# EAGLE schematic ESC (EAGLE 9.5.1)

## Sheet 1 of 8: Connectors
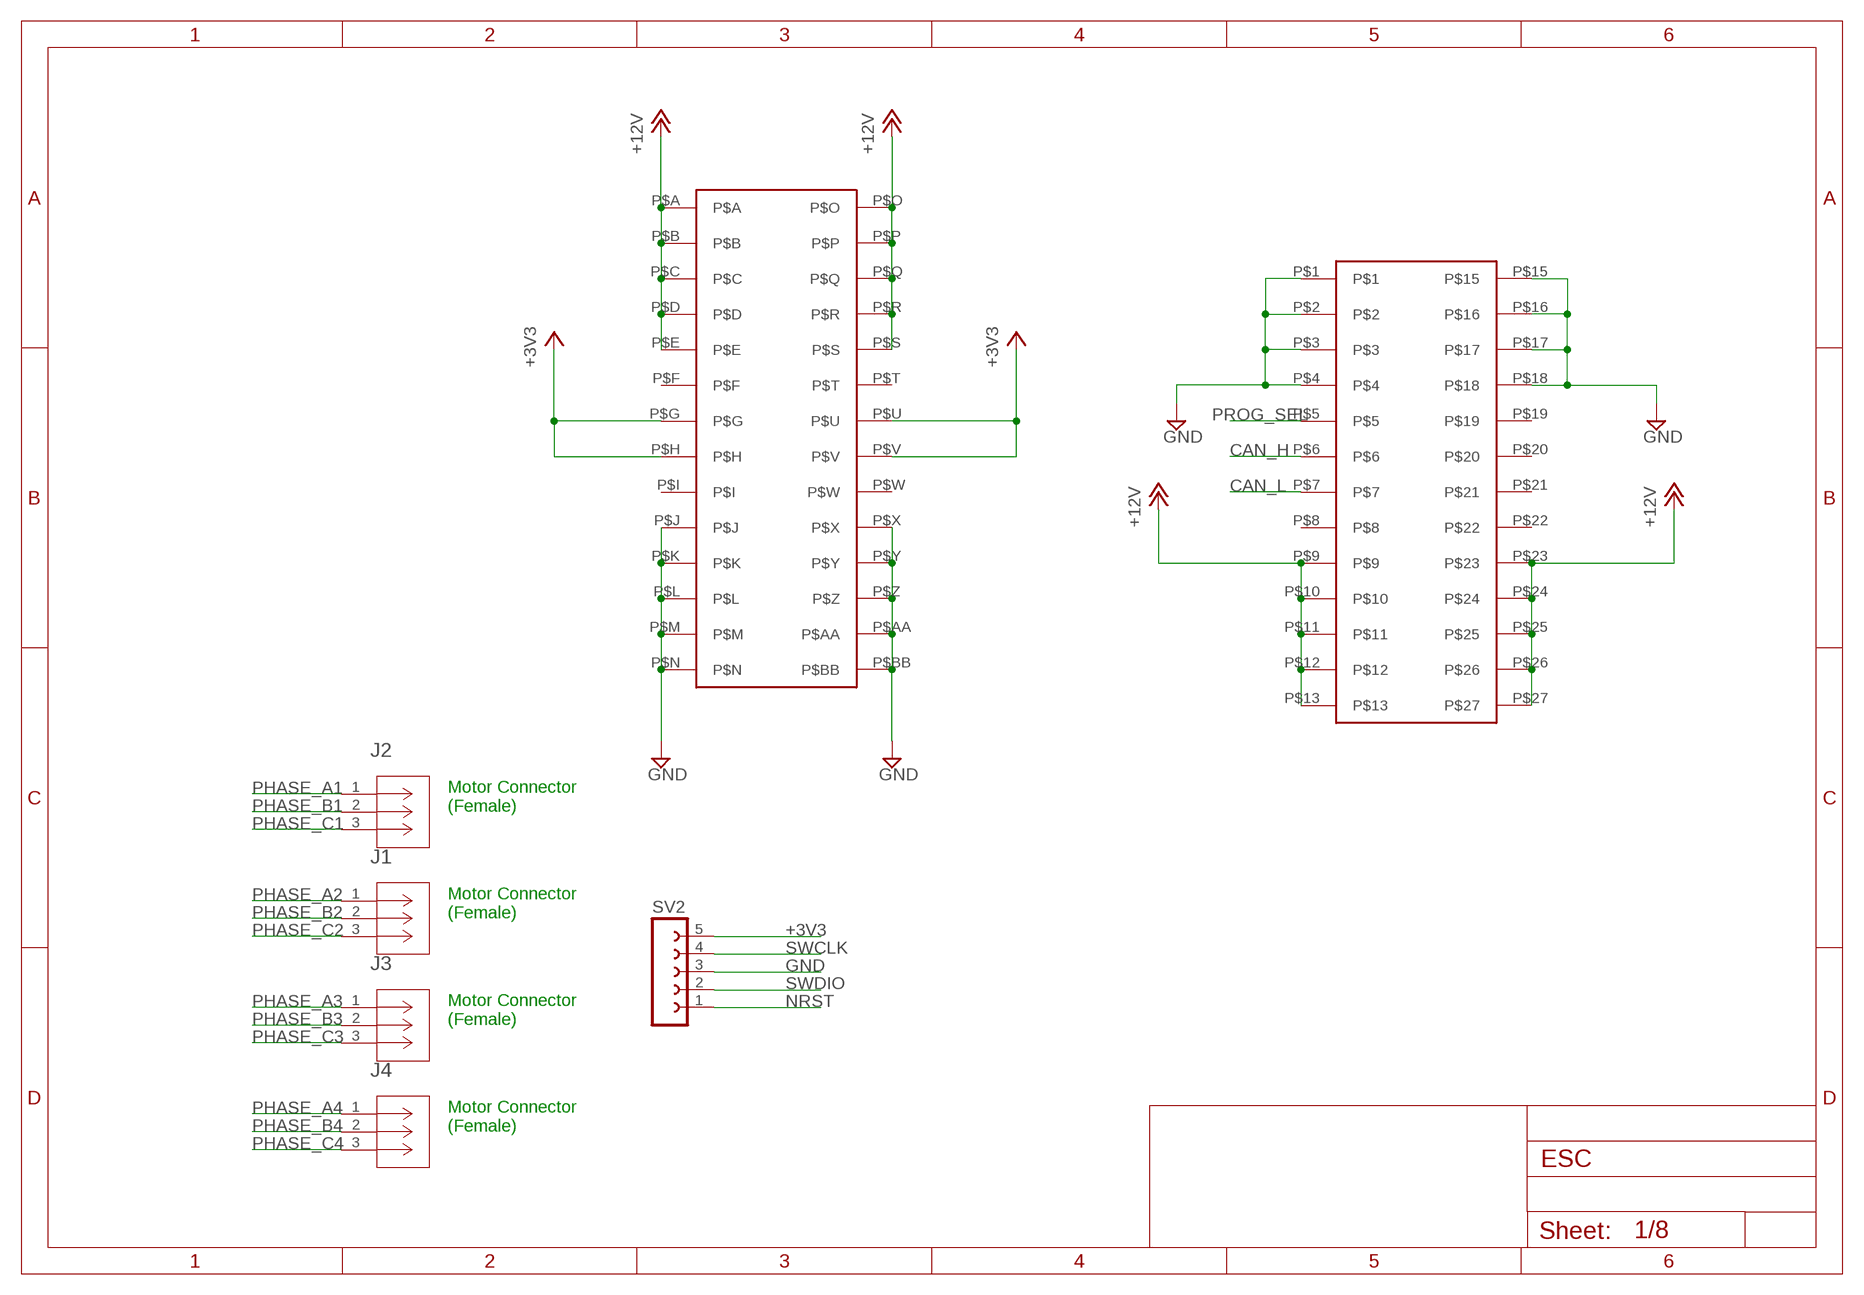
[diagram p0: schematic, sheet 1]

### Parts
J1  1755529  [CONN_1755529]
J2  1755529  [CONN_1755529]
J3  1755529  [CONN_1755529]
J4  1755529  [CONN_1755529]
SV2  FE05-1  [FE05-1]
U$5  ESC2BACKPLANE  [ESC2BACKPLANE_WHOLE]

### Nets
+3V3: SV2.5 U$5.P$G U$5.P$H U$5.P$U U$5.P$V ; also sheet 2,3,4
+12V: U$5.P$9 U$5.P$10 U$5.P$11 U$5.P$12 U$5.P$13 U$5.P$23 U$5.P$24 U$5.P$25 U$5.P$26 U$5.P$27 U$5.P$A U$5.P$B U$5.P$C U$5.P$D U$5.P$E U$5.P$O U$5.P$P U$5.P$Q U$5.P$R U$5.P$S
CAN_H: U$5.P$6 ; also sheet 3
CAN_L: U$5.P$7 ; also sheet 3
GND: SV2.3 U$5.P$1 U$5.P$2 U$5.P$3 U$5.P$4 U$5.P$15 U$5.P$16 U$5.P$17 U$5.P$18 U$5.P$AA U$5.P$BB U$5.P$J U$5.P$K U$5.P$L U$5.P$M U$5.P$N U$5.P$X U$5.P$Y U$5.P$Z ; also sheet 2,3,4,5,6,7,8
NRST: SV2.1 ; also sheet 2,4
PHASE_A1: J2.1 ; also sheet 5
PHASE_A2: J1.1 ; also sheet 6
PHASE_A3: J3.1 ; also sheet 7
PHASE_A4: J4.1 ; also sheet 8
PHASE_B1: J2.2 ; also sheet 5
PHASE_B2: J1.2 ; also sheet 6
PHASE_B3: J3.2 ; also sheet 7
PHASE_B4: J4.2 ; also sheet 8
PHASE_C1: J2.3 ; also sheet 5
PHASE_C2: J1.3 ; also sheet 6
PHASE_C3: J3.3 ; also sheet 7
PHASE_C4: J4.3 ; also sheet 8
PROG_SEL: U$5.P$5
SWCLK: SV2.4 ; also sheet 2,4
SWDIO: SV2.2 ; also sheet 2,4
Unconnected: U$5.P$8 U$5.P$19 U$5.P$20 U$5.P$21 U$5.P$22 U$5.P$F U$5.P$I U$5.P$T U$5.P$W

### Notes on the sheet
- Motor Connector
  (Female)
- Motor Connector
  (Female)
- Motor Connector
  (Female)
- Motor Connector
  (Female)

## Sheet 2 of 8: Multiplexer for flashing ig
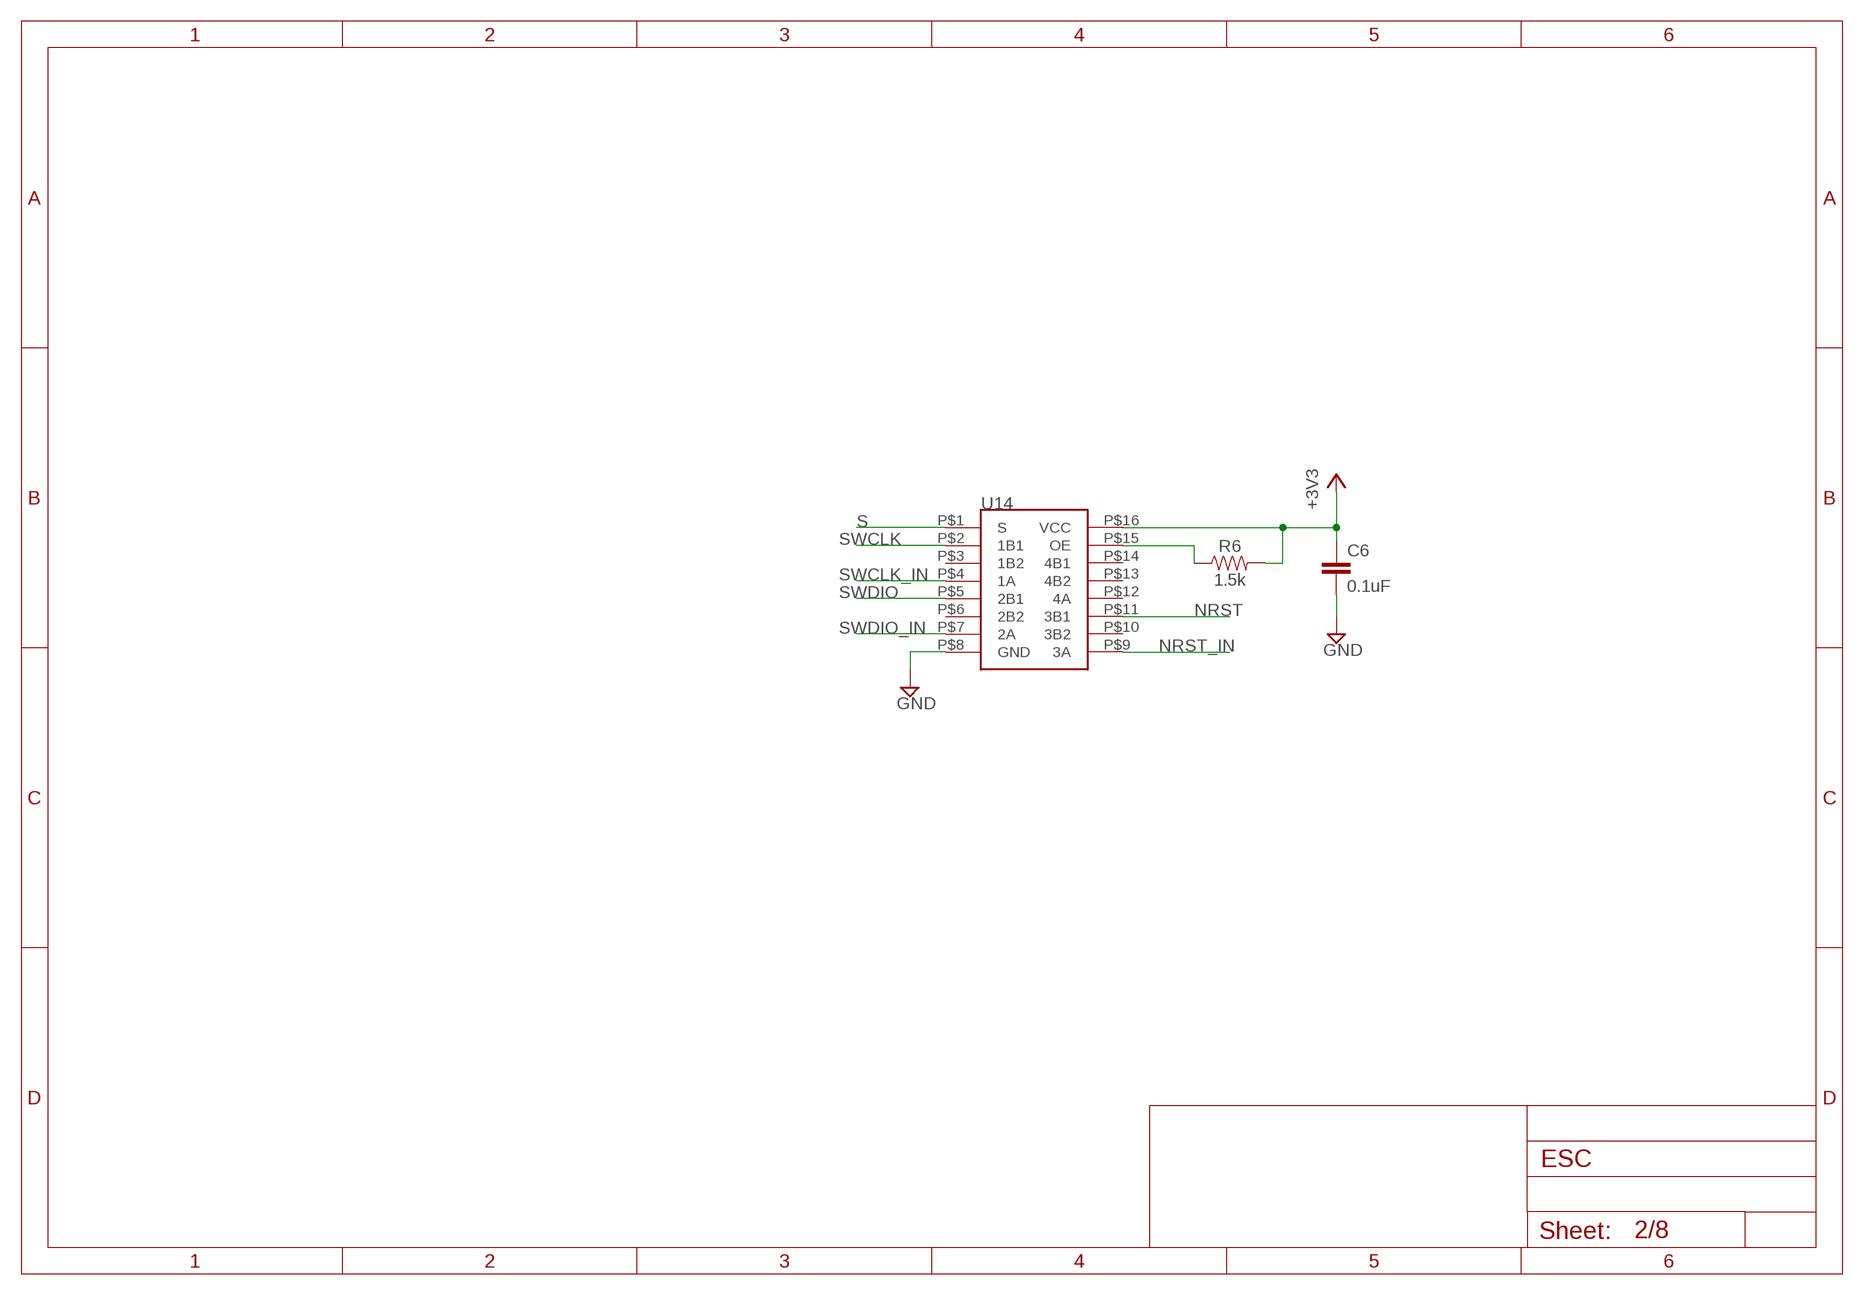
[diagram p1: schematic, sheet 2]

### Parts
C6  0.1uF  0.1UF-0603-25V-(+80/-20%)  [0603]
R6  1.5k  1.5KOHM-0603-1/10W-1%  [0603]
U14  SN74CBTLV3257PWR  [SN74CBTLV3257PWR]

### Nets
+3V3: C6.1 R6.2 U14.P$16(VCC) ; also sheet 1,3,4
GND: C6.2 U14.P$8(GND) ; also sheet 1,3,4,5,6,7,8
N$10: R6.1 U14.P$15(OE)
NRST: U14.P$11(3B1) ; also sheet 1,4
NRST_IN: U14.P$9(3A)
S: U14.P$1(S) ; also sheet 3
SWCLK: U14.P$2(1B1) ; also sheet 1,4
SWCLK_IN: U14.P$4(1A)
SWDIO: U14.P$5(2B1) ; also sheet 1,4
SWDIO_IN: U14.P$7(2A)
Unconnected: U14.P$3(1B2) U14.P$6(2B2) U14.P$10(3B2) U14.P$12(4A) U14.P$13(4B2) U14.P$14(4B1)

## Sheet 3 of 8: CAN
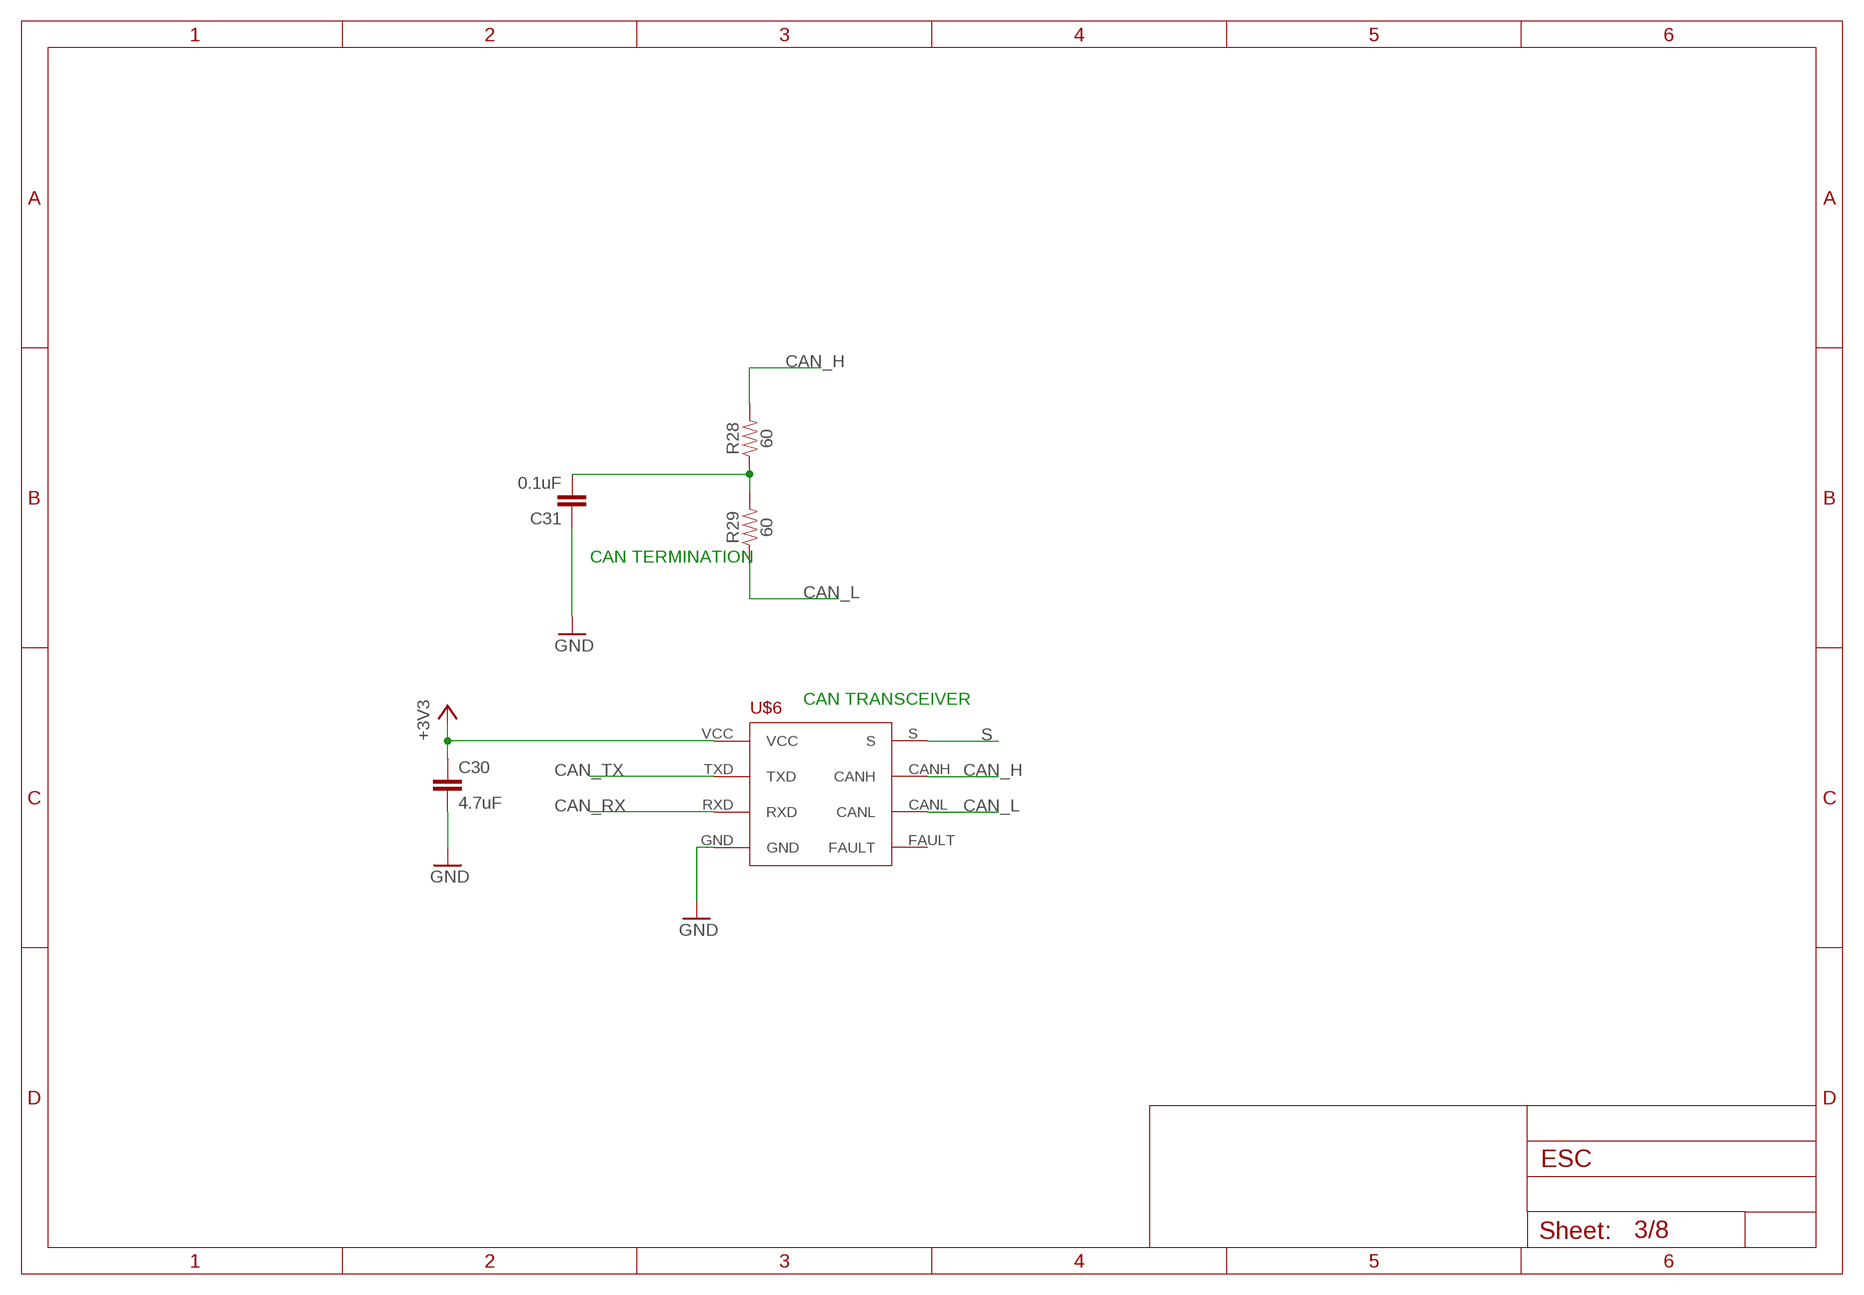
[diagram p2: schematic, sheet 3]

### Parts
C30  4.7uF  4.7UF0603  [0603]
C31  0.1uF  0.1UF-0603-25V-(+80/-20%)  [0603]
R28  60  1KOHM-0603-1/10W-1%  [0603]
R29  60  1KOHM-0603-1/10W-1%  [0603]
U$6  TCAN337D  [TCAN337D]

### Nets
+3V3: C30.1 U$6.VCC ; also sheet 1,2,4
CAN_H: R28.2 U$6.CANH ; also sheet 1
CAN_L: R29.1 U$6.CANL ; also sheet 1
CAN_RX: U$6.RXD ; also sheet 4
CAN_TX: U$6.TXD ; also sheet 4
GND: C30.2 C31.1 U$6.GND ; also sheet 1,2,4,5,6,7,8
N$46: C31.2 R28.1 R29.2
S: U$6.S ; also sheet 2
Unconnected: U$6.FAULT

### Notes on the sheet
- CAN TERMINATION
- CAN TRANSCEIVER

## Sheet 4 of 8: MCU board
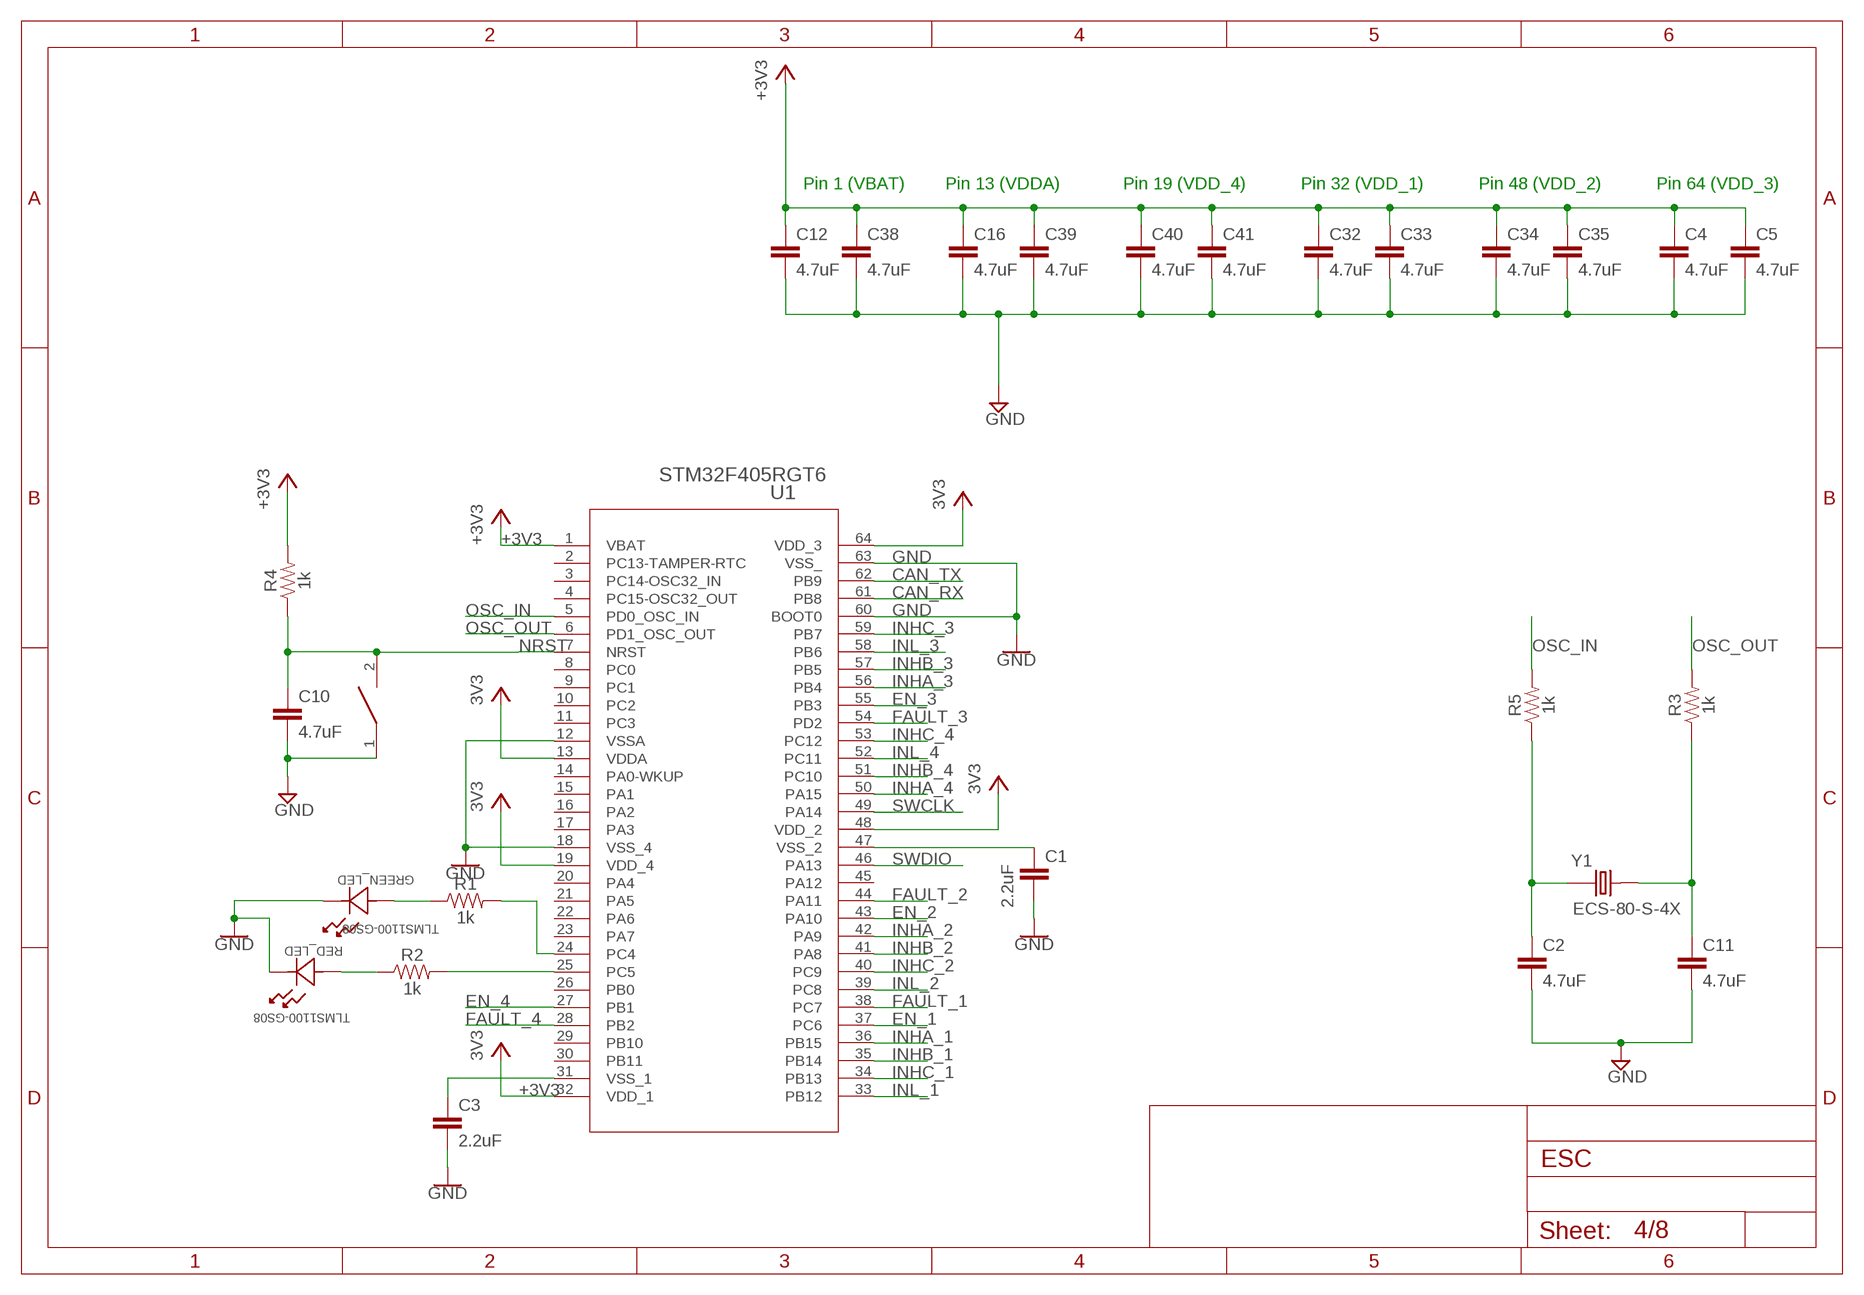
[diagram p3: schematic, sheet 4]

### Parts
C1  2.2uF  2.2UF-0603-10V-20%  [0603]
C2  4.7uF  4.7UF0603  [0603]
C3  2.2uF  2.2UF-0603-10V-20%  [0603]
C4  4.7uF  4.7UF0603  [0603]
C5  4.7uF  4.7UF0603  [0603]
C10  4.7uF  4.7UF0603  [0603]
C11  4.7uF  4.7UF0603  [0603]
C12  4.7uF  4.7UF0603  [0603]
C16  4.7uF  4.7UF0603  [0603]
C32  4.7uF  4.7UF0603  [0603]
C33  4.7uF  4.7UF0603  [0603]
C34  4.7uF  4.7UF0603  [0603]
C35  4.7uF  4.7UF0603  [0603]
C38  4.7uF  4.7UF0603  [0603]
C39  4.7uF  4.7UF0603  [0603]
C40  4.7uF  4.7UF0603  [0603]
C41  4.7uF  4.7UF0603  [0603]
GREEN_LED  TLMS1100-GS08  [LED_VISHAY_TLMX1100]
R1  1k  1KOHM-0603-1/10W-1%  [0603]
R2  1k  1KOHM-0603-1/10W-1%  [0603]
R3  1k  1KOHM-0603-1/10W-1%  [0603]
R4  1k  1KOHM-0603-1/10W-1%  [0603]
R5  1k  1KOHM-0603-1/10W-1%  [0603]
RED_LED  TLMS1100-GS08  [LED_VISHAY_TLMX1100]
RESET1  SWITCH  [SW_2512]
U1  STM32F405RGT6  [LQFP-64]
Y1  ECS-80-S-4X  [XTAL_ECS-80-S-4X]

### Nets
+3V3: C4.1 C5.1 C12.1 C16.1 C32.1 C33.1 C34.1 C35.1 C38.1 C39.1 C40.1 C41.1 R4.2 U1.1(VBAT) U1.13(VDDA) U1.19(VDD_4) U1.32(VDD_1) U1.48(VDD_2) U1.64(VDD_3) ; supply symbol labelled 3V3 ; also sheet 1,2,3
CAN_RX: U1.61(PB8) ; also sheet 3
CAN_TX: U1.62(PB9) ; also sheet 3
EN_1: U1.37(PC6) ; also sheet 5
EN_2: U1.43(PA10) ; also sheet 6
EN_3: U1.55(PB3) ; also sheet 7
EN_4: U1.27(PB1) ; also sheet 8
FAULT_1: U1.38(PC7) ; also sheet 5
FAULT_2: U1.44(PA11) ; also sheet 6
FAULT_3: U1.54(PD2) ; also sheet 7
FAULT_4: U1.28(PB2) ; also sheet 8
GND: C1.2 C2.2 C3.2 C4.2 C5.2 C10.2 C11.2 C12.2 C16.2 C32.2 C33.2 C34.2 C35.2 C38.2 C39.2 C40.2 C41.2 GREEN_LED.1 RED_LED.1 RESET1.1 U1.12(VSSA) U1.18(VSS_4) U1.60(BOOT0) U1.63(VSS_) ; also sheet 1,2,3,5,6,7,8
INHA_1: U1.36(PB15) ; also sheet 5
INHA_2: U1.42(PA9) ; also sheet 6
INHA_3: U1.56(PB4) ; also sheet 7
INHA_4: U1.50(PA15) ; also sheet 8
INHB_1: U1.35(PB14) ; also sheet 5
INHB_2: U1.41(PA8) ; also sheet 6
INHB_3: U1.57(PB5) ; also sheet 7
INHB_4: U1.51(PC10) ; also sheet 8
INHC_1: U1.34(PB13) ; also sheet 5
INHC_2: U1.40(PC9) ; also sheet 6
INHC_3: U1.59(PB7) ; also sheet 7
INHC_4: U1.53(PC12) ; also sheet 8
INL_1: U1.33(PB12) ; also sheet 5
INL_2: U1.39(PC8) ; also sheet 6
INL_3: U1.58(PB6) ; also sheet 7
INL_4: U1.52(PC11) ; also sheet 8
N$1: R1.2 U1.24(PC4)
N$2: GREEN_LED.2 R1.1
N$3: R2.1 RED_LED.2
N$4: R2.2 U1.25(PC5)
N$5: C1.1 U1.47(VSS_2)
N$6: C3.1 U1.31(VSS_1)
N$7: C11.1 R3.1 Y1.2
N$8: C2.1 R5.1 Y1.1
NRST: C10.1 R4.1 RESET1.2 U1.7(NRST) ; also sheet 1,2
OSC_IN: R5.2 U1.5(PD0_OSC_IN)
OSC_OUT: R3.2 U1.6(PD1_OSC_OUT)
SWCLK: U1.49(PA14) ; also sheet 1,2
SWDIO: U1.46(PA13) ; also sheet 1,2
Unconnected: U1.2(PC13-TAMPER-RTC) U1.3(PC14-OSC32_IN) U1.4(PC15-OSC32_OUT) U1.8(PC0) U1.9(PC1) U1.10(PC2) U1.11(PC3) U1.14(PA0-WKUP) U1.15(PA1) U1.16(PA2) U1.17(PA3) U1.20(PA4) U1.21(PA5) U1.22(PA6) U1.23(PA7) U1.26(PB0) U1.29(PB10) U1.30(PB11) U1.45(PA12)

### Notes on the sheet
- Pin 1 (VBAT) | Pin 13 (VDDA) | Pin 19 (VDD_4) | Pin 32 (VDD_1) | Pin 48 (VDD_2) | Pin 64 (VDD_3)

## Sheet 5 of 8
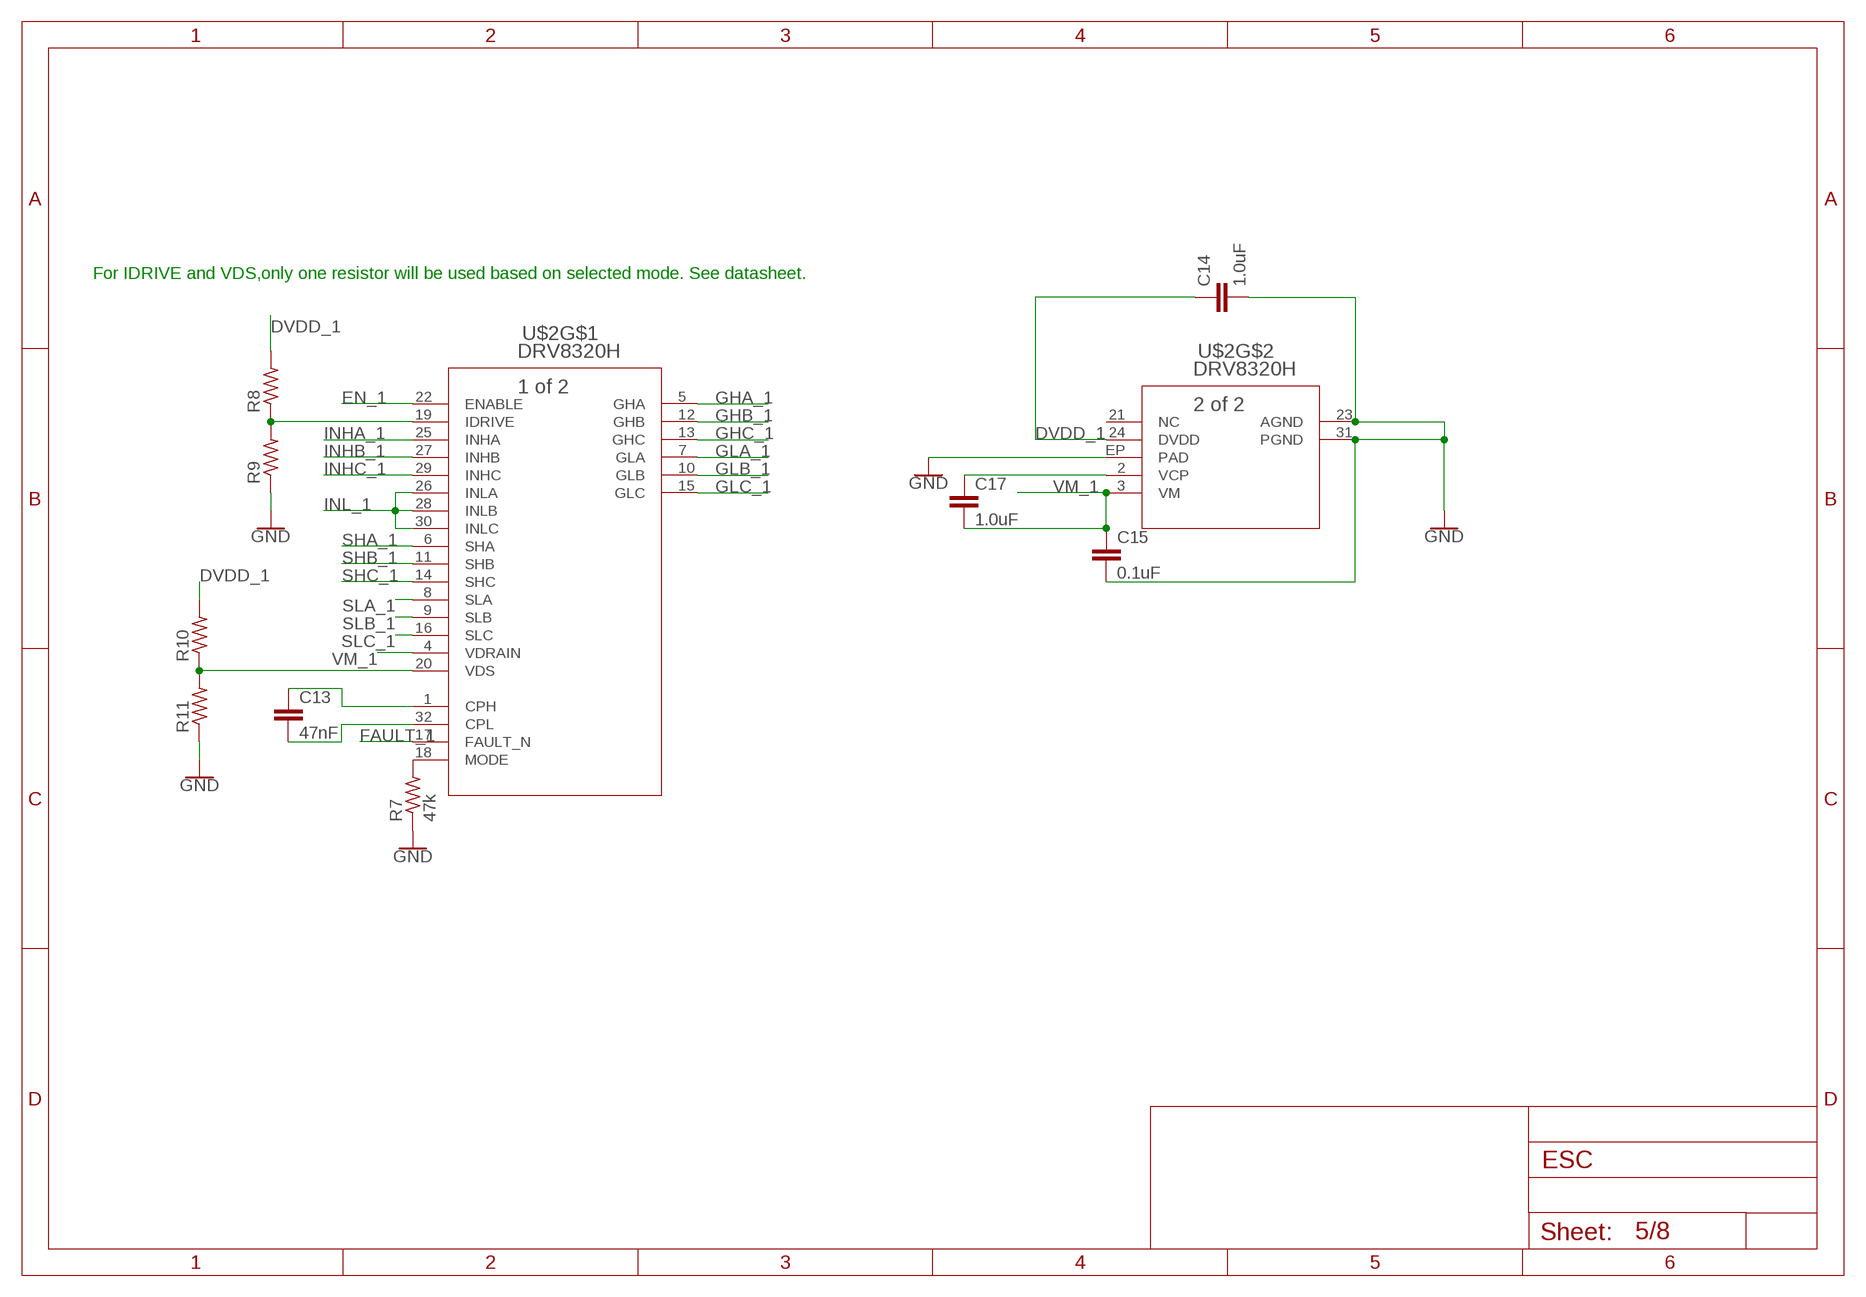
[diagram p4: schematic, sheet 5, part 1 of 2]
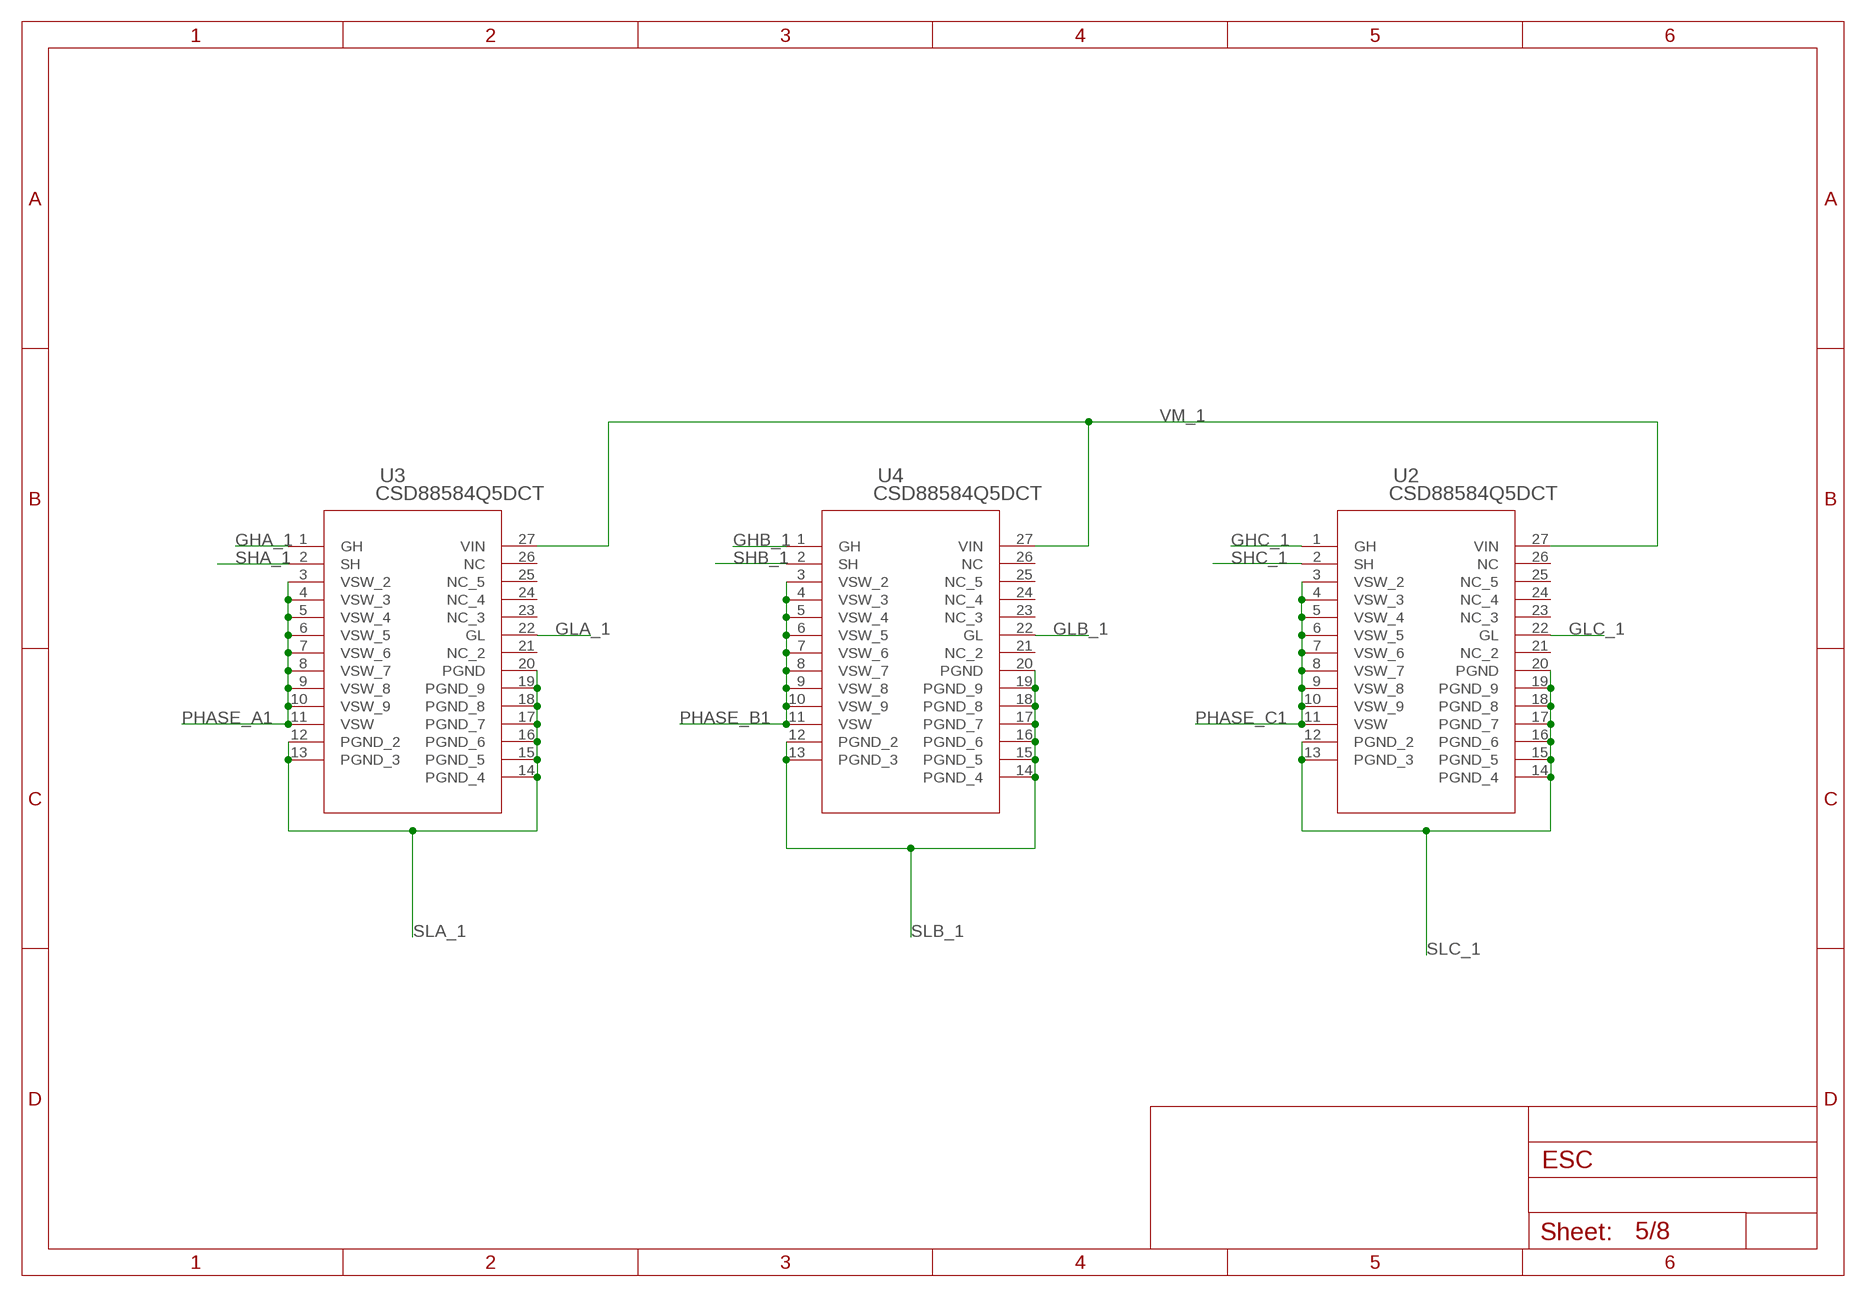
[diagram p5: schematic, sheet 5, part 2 of 2]

### Parts
C13  47nF  47NF-0603-25V-5%  [0603]
C14  1.0uF  1.0UF-0603-16V-10%  [0603]
C15  0.1uF  0.1UF-0603-25V-(+80/-20%)  [0603]
C17  1.0uF  1.0UF-0603-16V-10%  [0603]
R7  47k  R-US_R0603  [R0603]
R8  R-US_R0603  [R0603]
R9  R-US_R0603  [R0603]
R10  R-US_R0603  [R0603]
R11  R-US_R0603  [R0603]
U2  CSD88584Q5DCT  [DMM0022A]
U3  CSD88584Q5DCT  [DMM0022A]
U4  CSD88584Q5DCT  [DMM0022A]
U$2  DRV8320H  [QFN-32-5X5MM]

### Nets
DVDD_1: C14.1 R8.2 R10.2 U$2.24(DVDD)
EN_1: U$2.22(ENABLE) ; also sheet 4
FAULT_1: U$2.17(FAULT_N) ; also sheet 4
GHA_1: U3.1(GH) U$2.5(GHA)
GHB_1: U4.1(GH) U$2.12(GHB)
GHC_1: U2.1(GH) U$2.13(GHC)
GLA_1: U3.22(GL) U$2.7(GLA)
GLB_1: U4.22(GL) U$2.10(GLB)
GLC_1: U2.22(GL) U$2.15(GLC)
GND: C14.2 C15.2 R7.1 R9.1 R11.1 U$2.23(AGND) U$2.31(PGND) U$2.EP(PAD) ; also sheet 1,2,3,4,6,7,8
INHA_1: U$2.25(INHA) ; also sheet 4
INHB_1: U$2.27(INHB) ; also sheet 4
INHC_1: U$2.29(INHC) ; also sheet 4
INL_1: U$2.26(INLA) U$2.28(INLB) U$2.30(INLC) ; also sheet 4
N$9: C13.1 U$2.1(CPH)
N$16: C13.2 U$2.32(CPL)
N$17: R8.1 R9.2 U$2.19(IDRIVE)
N$18: R7.2 U$2.18(MODE)
N$19: R10.1 R11.2 U$2.20(VDS)
N$34: C17.1 U$2.2(VCP)
PHASE_A1: U3.3(VSW_2) U3.4(VSW_3) U3.5(VSW_4) U3.6(VSW_5) U3.7(VSW_6) U3.8(VSW_7) U3.9(VSW_8) U3.10(VSW_9) U3.11(VSW) ; also sheet 1
PHASE_B1: U4.3(VSW_2) U4.4(VSW_3) U4.5(VSW_4) U4.6(VSW_5) U4.7(VSW_6) U4.8(VSW_7) U4.9(VSW_8) U4.10(VSW_9) U4.11(VSW) ; also sheet 1
PHASE_C1: U2.3(VSW_2) U2.4(VSW_3) U2.5(VSW_4) U2.6(VSW_5) U2.7(VSW_6) U2.8(VSW_7) U2.9(VSW_8) U2.10(VSW_9) U2.11(VSW) ; also sheet 1
SHA_1: U3.2(SH) U$2.6(SHA)
SHB_1: U4.2(SH) U$2.11(SHB)
SHC_1: U2.2(SH) U$2.14(SHC)
SLA_1: U3.12(PGND_2) U3.13(PGND_3) U3.14(PGND_4) U3.15(PGND_5) U3.16(PGND_6) U3.17(PGND_7) U3.18(PGND_8) U3.19(PGND_9) U3.20(PGND) U$2.8(SLA)
SLB_1: U4.12(PGND_2) U4.13(PGND_3) U4.14(PGND_4) U4.15(PGND_5) U4.16(PGND_6) U4.17(PGND_7) U4.18(PGND_8) U4.19(PGND_9) U4.20(PGND) U$2.9(SLB)
SLC_1: U2.12(PGND_2) U2.13(PGND_3) U2.14(PGND_4) U2.15(PGND_5) U2.16(PGND_6) U2.17(PGND_7) U2.18(PGND_8) U2.19(PGND_9) U2.20(PGND) U$2.16(SLC)
VM_1: C15.1 C17.2 U2.27(VIN) U3.27(VIN) U4.27(VIN) U$2.3(VM) U$2.4(VDRAIN)
Unconnected: U2.21(NC_2) U2.23(NC_3) U2.24(NC_4) U2.25(NC_5) U2.26(NC) U3.21(NC_2) U3.23(NC_3) U3.24(NC_4) U3.25(NC_5) U3.26(NC) U4.21(NC_2) U4.23(NC_3) U4.24(NC_4) U4.25(NC_5) U4.26(NC) U$2.21(NC)

### Notes on the sheet
- For IDRIVE and VDS,only one resistor will be used based on selected mode. See datasheet.

## Sheet 6 of 8
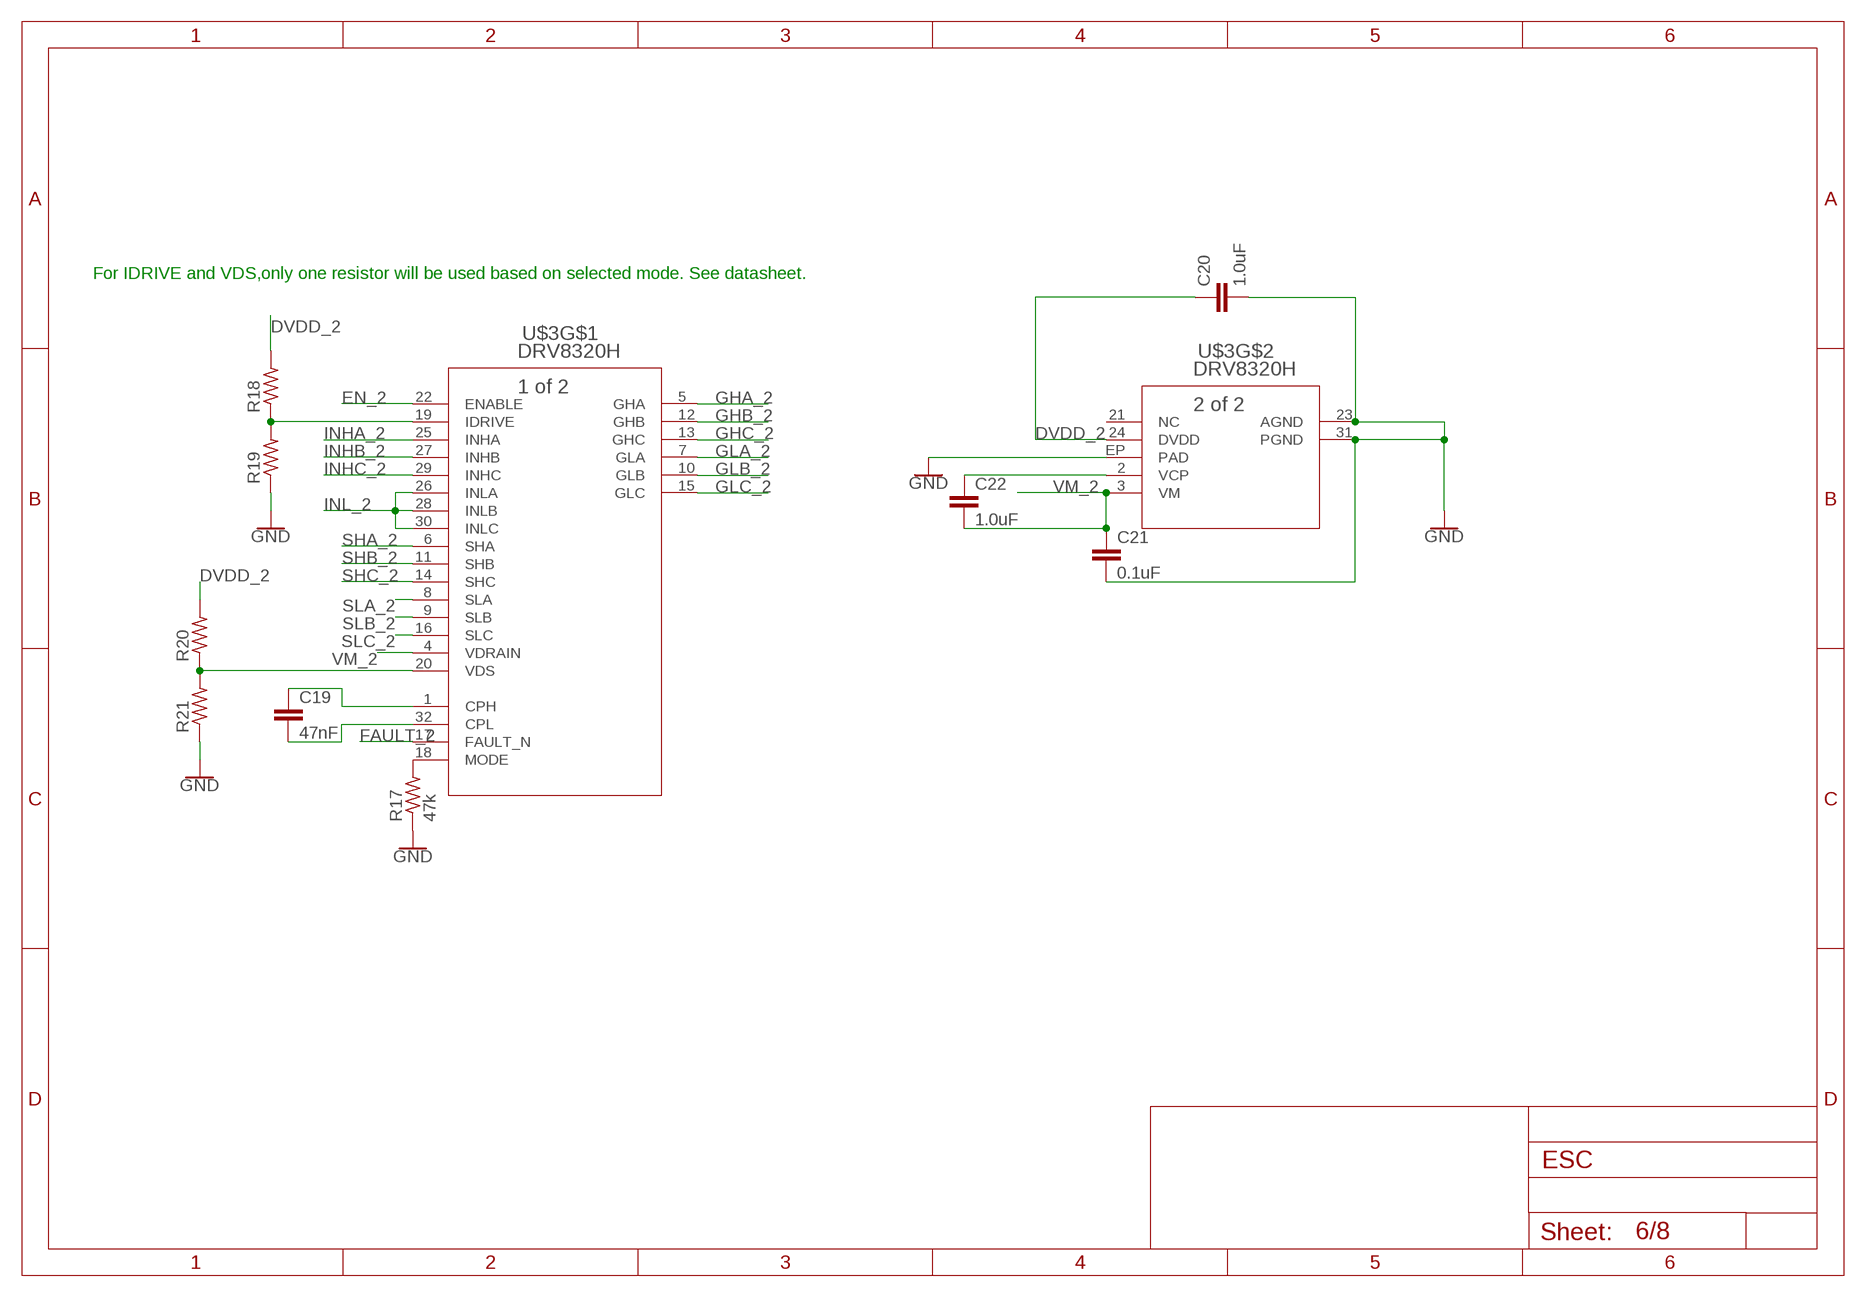
[diagram p6: schematic, sheet 6, part 1 of 2]
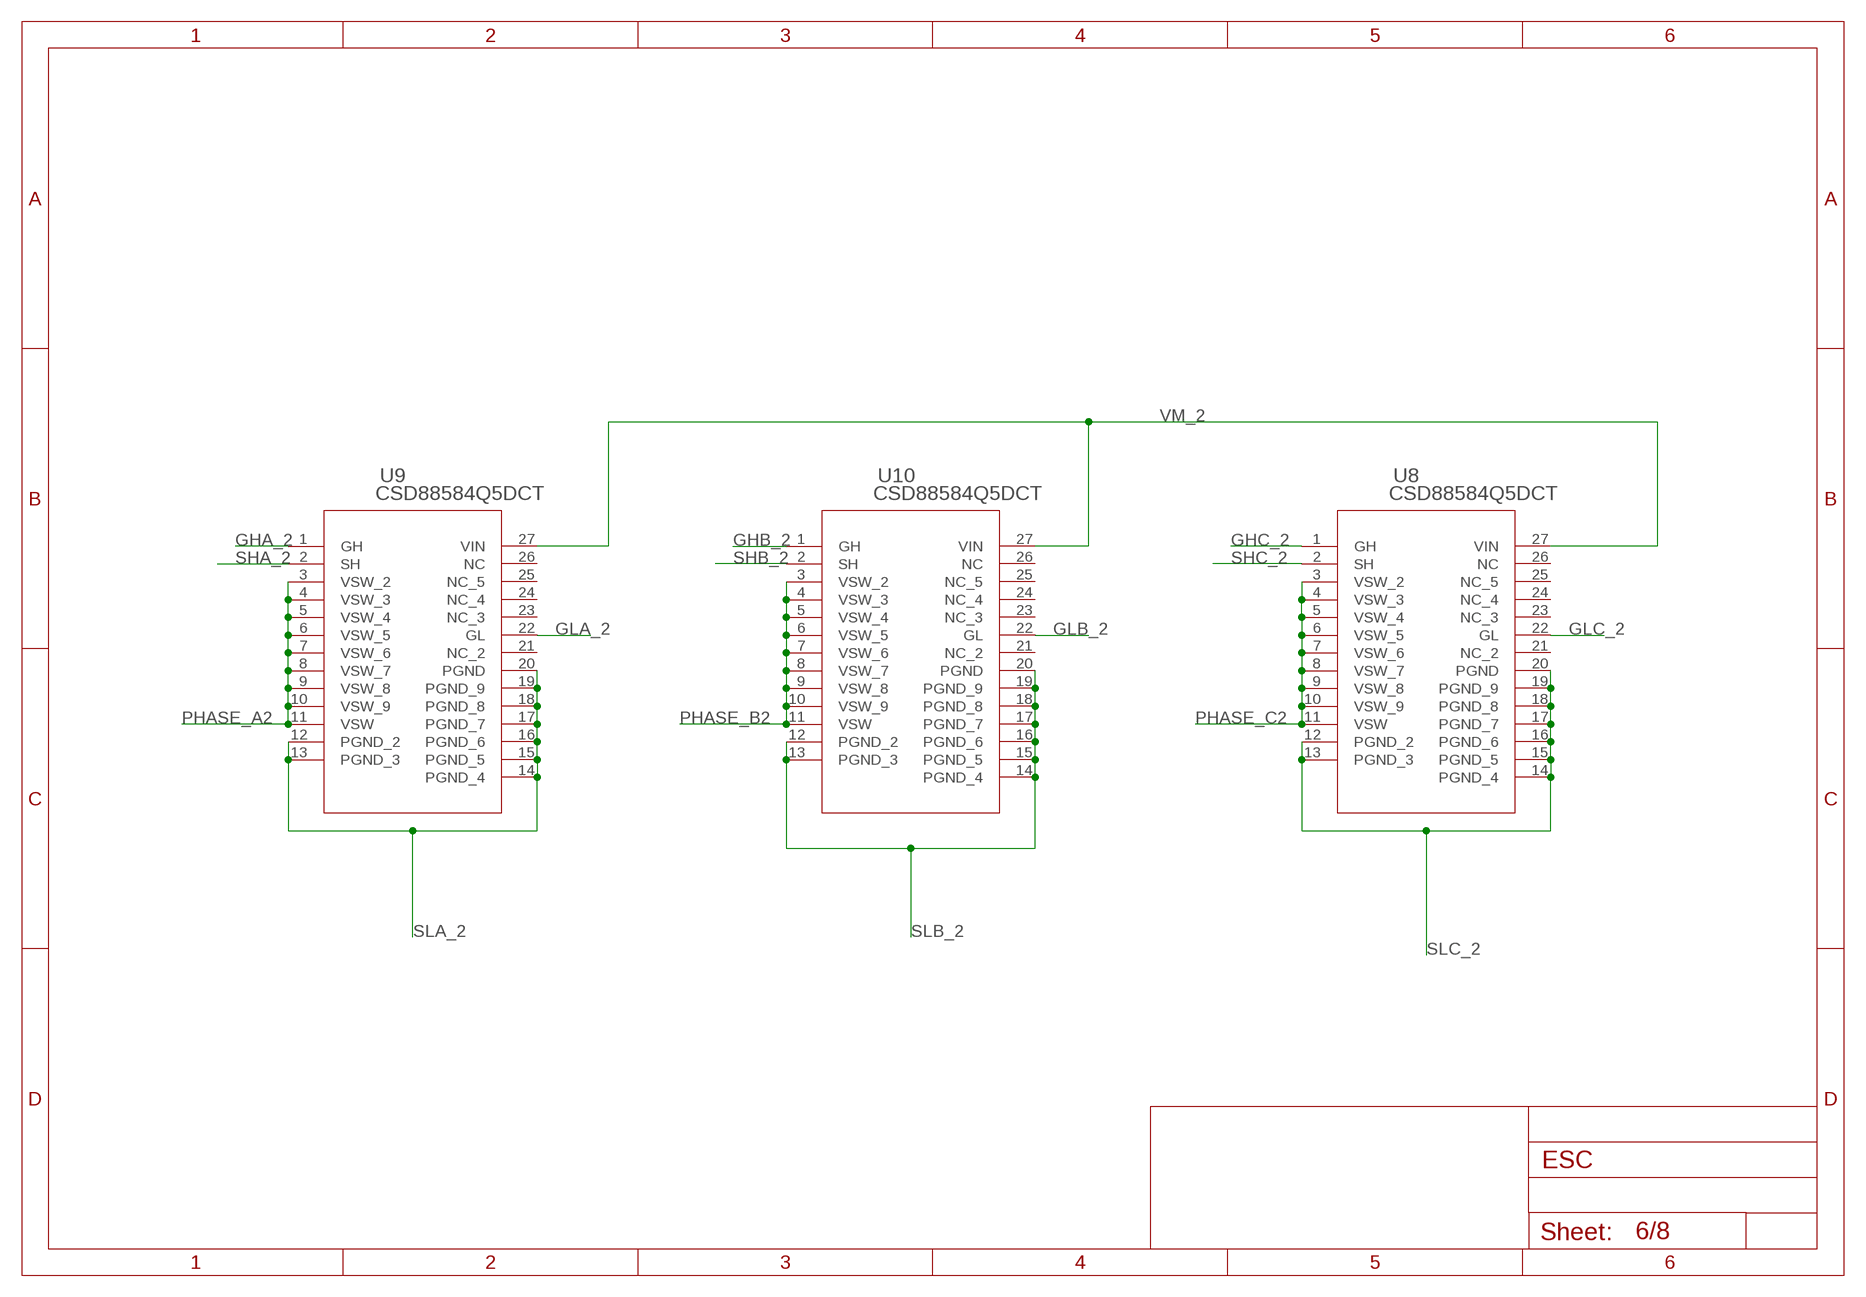
[diagram p7: schematic, sheet 6, part 2 of 2]

### Parts
C19  47nF  47NF-0603-25V-5%  [0603]
C20  1.0uF  1.0UF-0603-16V-10%  [0603]
C21  0.1uF  0.1UF-0603-25V-(+80/-20%)  [0603]
C22  1.0uF  1.0UF-0603-16V-10%  [0603]
R17  47k  R-US_R0603  [R0603]
R18  R-US_R0603  [R0603]
R19  R-US_R0603  [R0603]
R20  R-US_R0603  [R0603]
R21  R-US_R0603  [R0603]
U8  CSD88584Q5DCT  [DMM0022A]
U9  CSD88584Q5DCT  [DMM0022A]
U10  CSD88584Q5DCT  [DMM0022A]
U$3  DRV8320H  [QFN-32-5X5MM]

### Nets
DVDD_2: C20.1 R18.2 R20.2 U$3.24(DVDD)
EN_2: U$3.22(ENABLE) ; also sheet 4
FAULT_2: U$3.17(FAULT_N) ; also sheet 4
GHA_2: U9.1(GH) U$3.5(GHA)
GHB_2: U10.1(GH) U$3.12(GHB)
GHC_2: U8.1(GH) U$3.13(GHC)
GLA_2: U9.22(GL) U$3.7(GLA)
GLB_2: U10.22(GL) U$3.10(GLB)
GLC_2: U8.22(GL) U$3.15(GLC)
GND: C20.2 C21.2 R17.1 R19.1 R21.1 U$3.23(AGND) U$3.31(PGND) U$3.EP(PAD) ; also sheet 1,2,3,4,5,7,8
INHA_2: U$3.25(INHA) ; also sheet 4
INHB_2: U$3.27(INHB) ; also sheet 4
INHC_2: U$3.29(INHC) ; also sheet 4
INL_2: U$3.26(INLA) U$3.28(INLB) U$3.30(INLC) ; also sheet 4
N$11: R17.2 U$3.18(MODE)
N$21: C22.1 U$3.2(VCP)
N$22: C19.1 U$3.1(CPH)
N$23: C19.2 U$3.32(CPL)
N$24: R18.1 R19.2 U$3.19(IDRIVE)
N$26: R20.1 R21.2 U$3.20(VDS)
PHASE_A2: U9.3(VSW_2) U9.4(VSW_3) U9.5(VSW_4) U9.6(VSW_5) U9.7(VSW_6) U9.8(VSW_7) U9.9(VSW_8) U9.10(VSW_9) U9.11(VSW) ; also sheet 1
PHASE_B2: U10.3(VSW_2) U10.4(VSW_3) U10.5(VSW_4) U10.6(VSW_5) U10.7(VSW_6) U10.8(VSW_7) U10.9(VSW_8) U10.10(VSW_9) U10.11(VSW) ; also sheet 1
PHASE_C2: U8.3(VSW_2) U8.4(VSW_3) U8.5(VSW_4) U8.6(VSW_5) U8.7(VSW_6) U8.8(VSW_7) U8.9(VSW_8) U8.10(VSW_9) U8.11(VSW) ; also sheet 1
SHA_2: U9.2(SH) U$3.6(SHA)
SHB_2: U10.2(SH) U$3.11(SHB)
SHC_2: U8.2(SH) U$3.14(SHC)
SLA_2: U9.12(PGND_2) U9.13(PGND_3) U9.14(PGND_4) U9.15(PGND_5) U9.16(PGND_6) U9.17(PGND_7) U9.18(PGND_8) U9.19(PGND_9) U9.20(PGND) U$3.8(SLA)
SLB_2: U10.12(PGND_2) U10.13(PGND_3) U10.14(PGND_4) U10.15(PGND_5) U10.16(PGND_6) U10.17(PGND_7) U10.18(PGND_8) U10.19(PGND_9) U10.20(PGND) U$3.9(SLB)
SLC_2: U8.12(PGND_2) U8.13(PGND_3) U8.14(PGND_4) U8.15(PGND_5) U8.16(PGND_6) U8.17(PGND_7) U8.18(PGND_8) U8.19(PGND_9) U8.20(PGND) U$3.16(SLC)
VM_2: C21.1 C22.2 U8.27(VIN) U9.27(VIN) U10.27(VIN) U$3.3(VM) U$3.4(VDRAIN)
Unconnected: U8.21(NC_2) U8.23(NC_3) U8.24(NC_4) U8.25(NC_5) U8.26(NC) U9.21(NC_2) U9.23(NC_3) U9.24(NC_4) U9.25(NC_5) U9.26(NC) U10.21(NC_2) U10.23(NC_3) U10.24(NC_4) U10.25(NC_5) U10.26(NC) U$3.21(NC)

### Notes on the sheet
- For IDRIVE and VDS,only one resistor will be used based on selected mode. See datasheet.

## Sheet 7 of 8
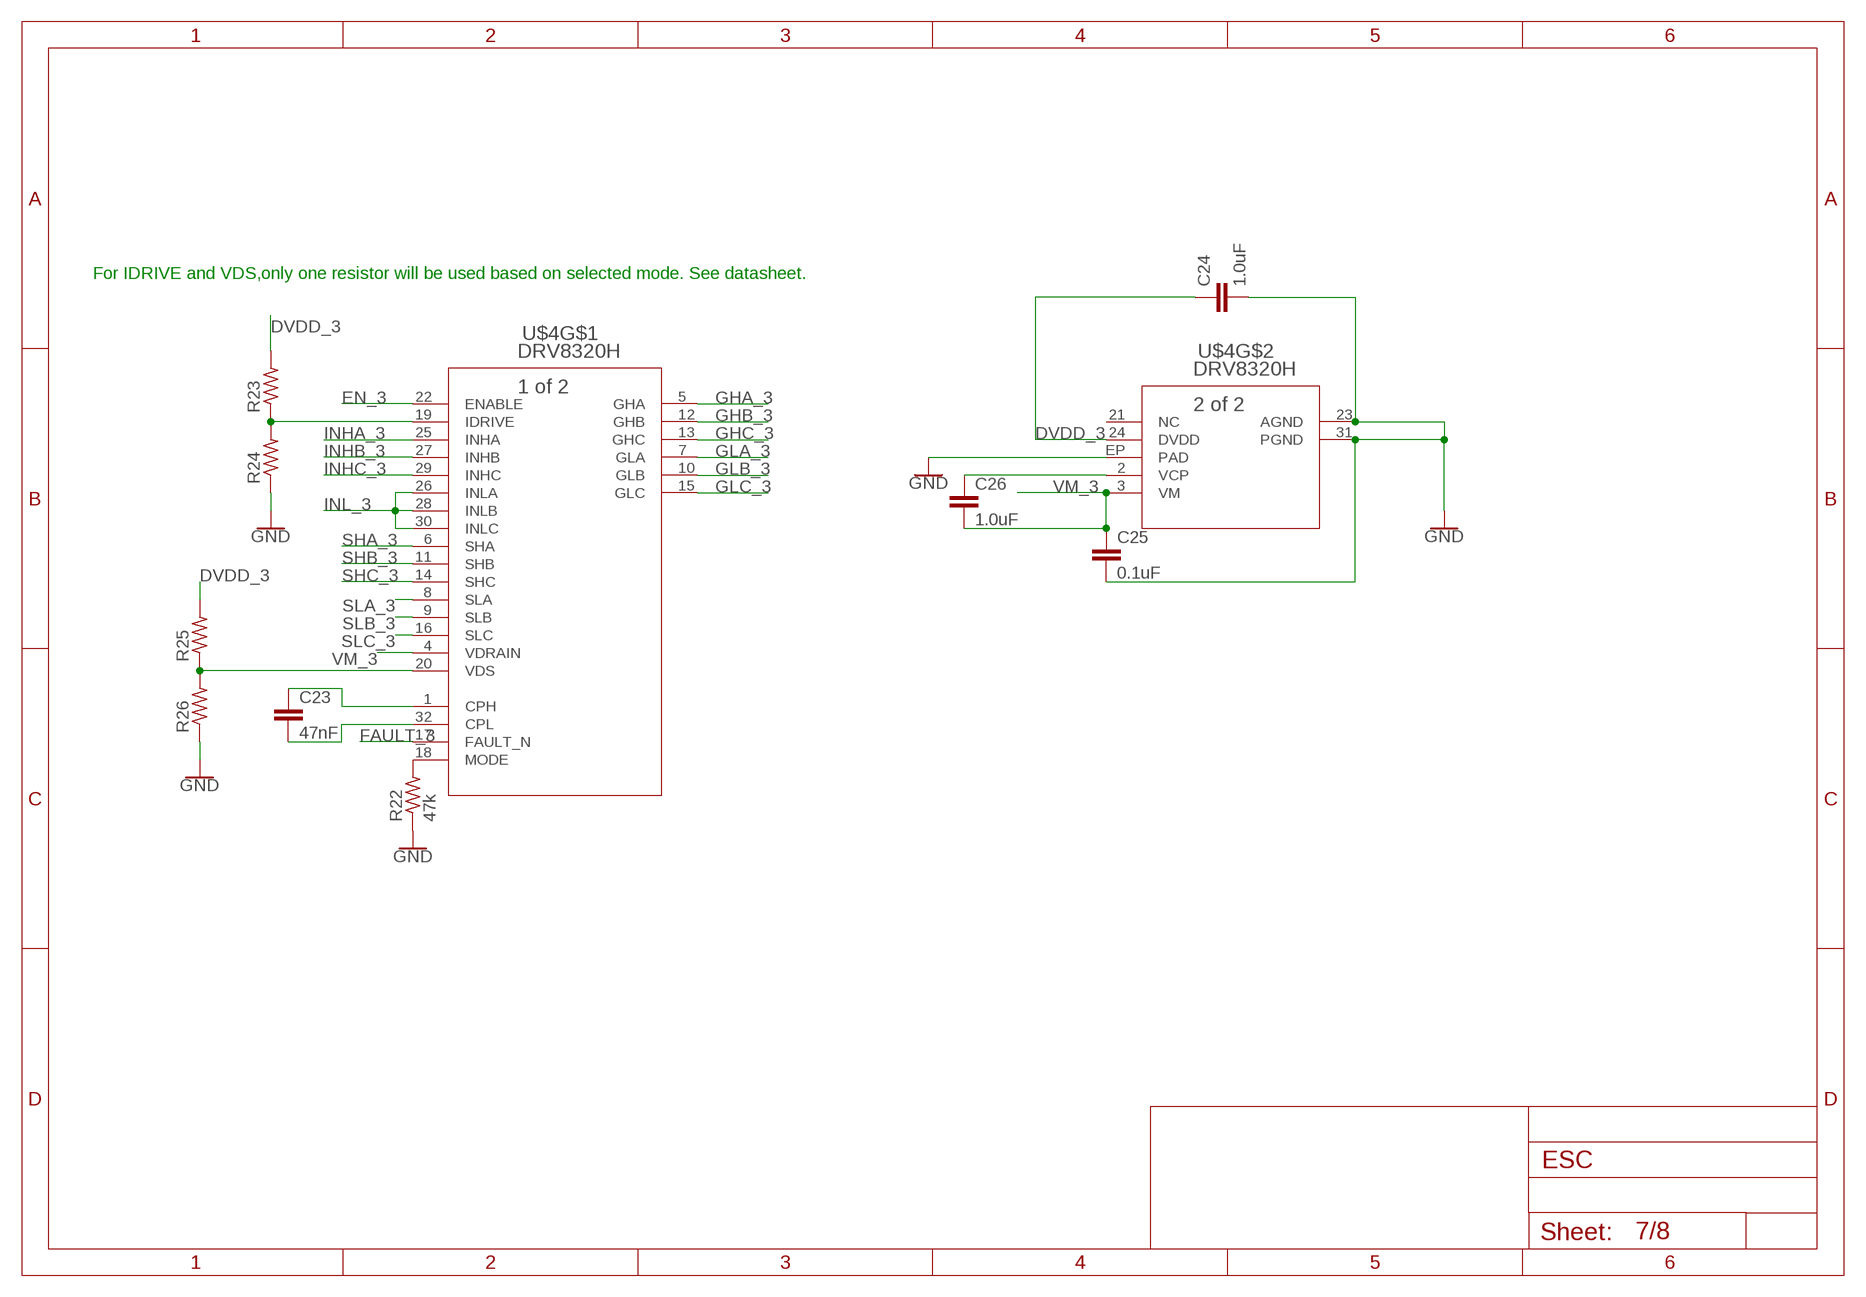
[diagram p8: schematic, sheet 7, part 1 of 2]
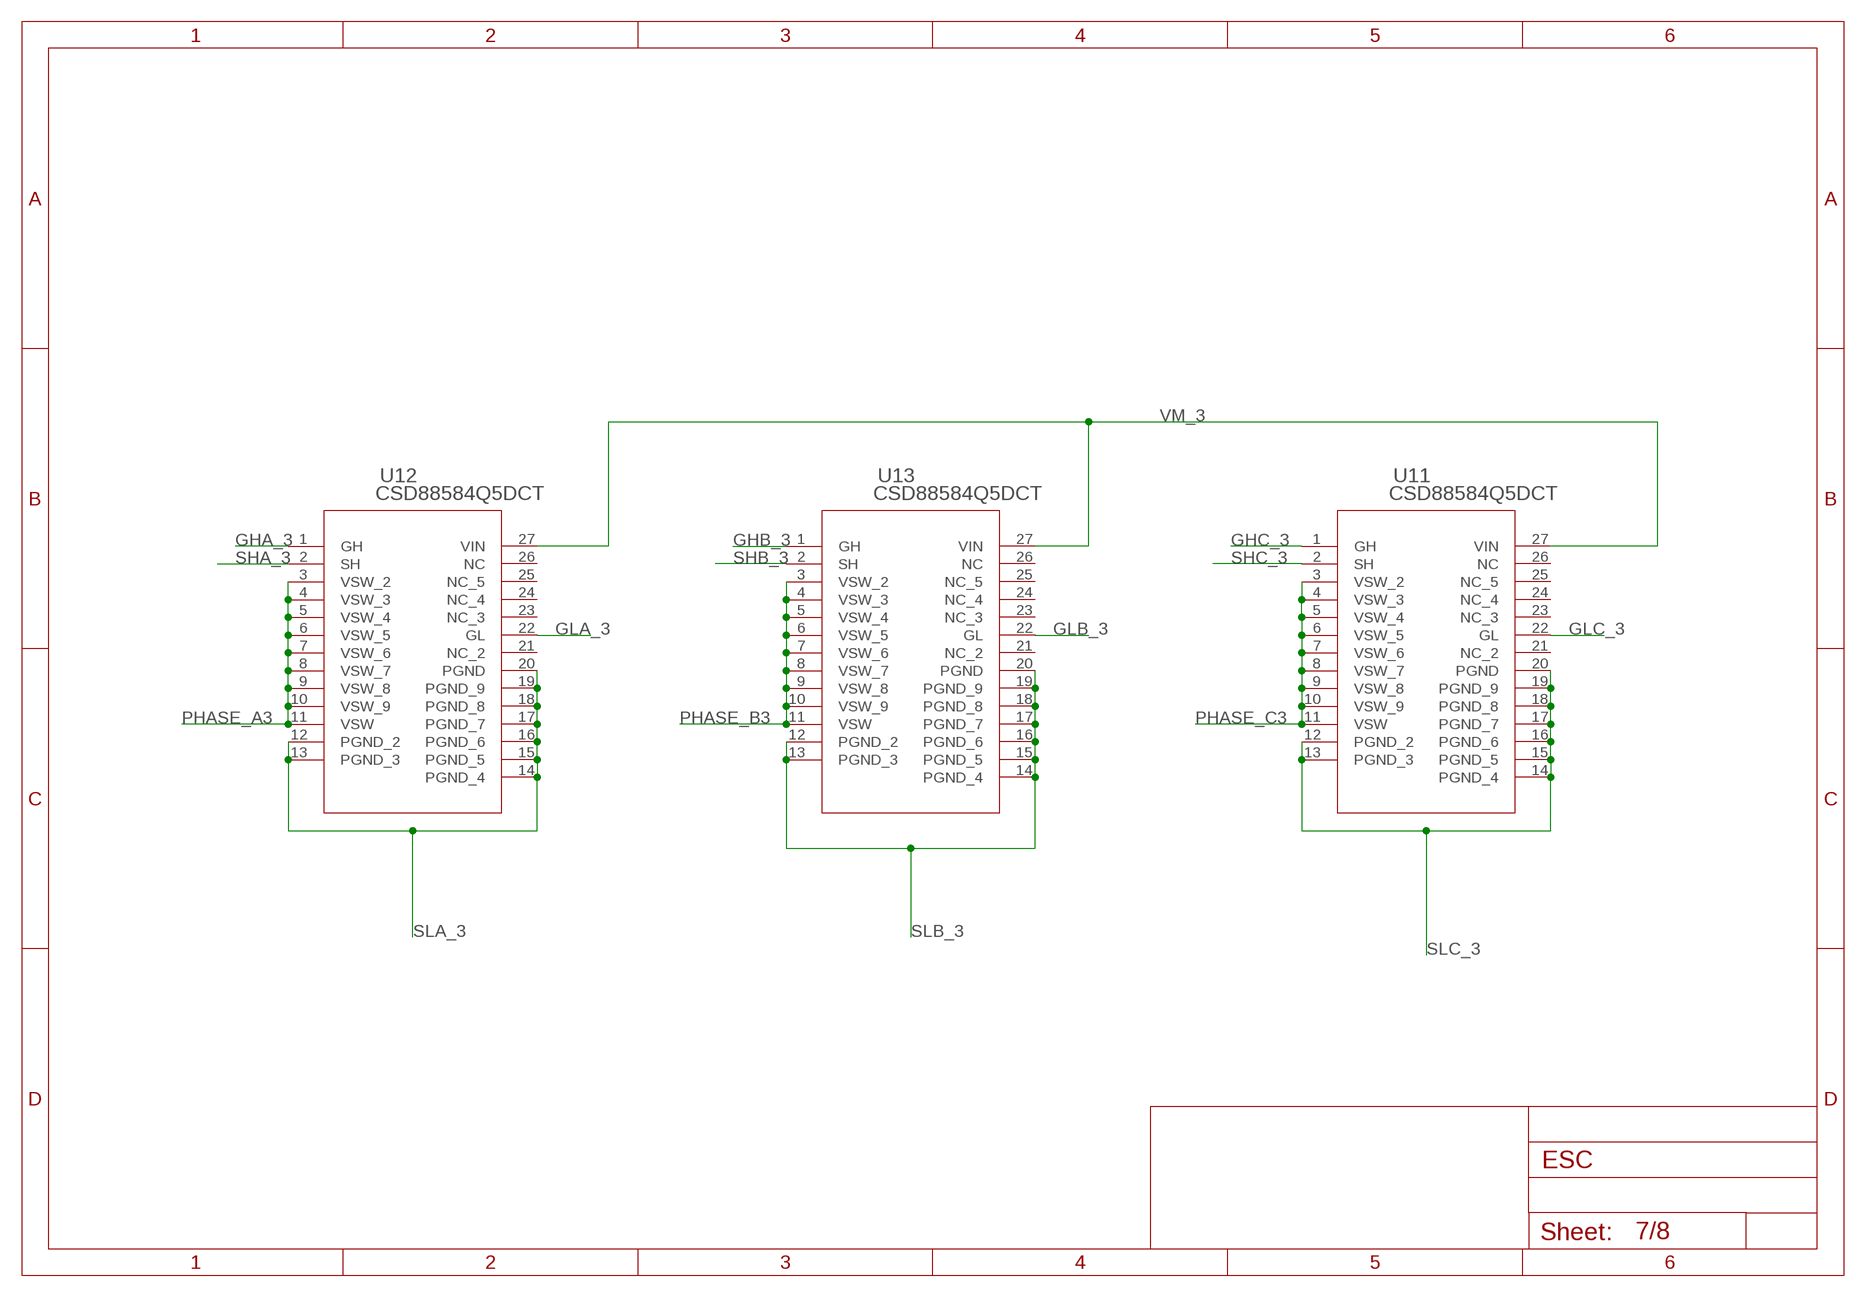
[diagram p9: schematic, sheet 7, part 2 of 2]

### Parts
C23  47nF  47NF-0603-25V-5%  [0603]
C24  1.0uF  1.0UF-0603-16V-10%  [0603]
C25  0.1uF  0.1UF-0603-25V-(+80/-20%)  [0603]
C26  1.0uF  1.0UF-0603-16V-10%  [0603]
R22  47k  R-US_R0603  [R0603]
R23  R-US_R0603  [R0603]
R24  R-US_R0603  [R0603]
R25  R-US_R0603  [R0603]
R26  R-US_R0603  [R0603]
U11  CSD88584Q5DCT  [DMM0022A]
U12  CSD88584Q5DCT  [DMM0022A]
U13  CSD88584Q5DCT  [DMM0022A]
U$4  DRV8320H  [QFN-32-5X5MM]

### Nets
DVDD_3: C24.1 R23.2 R25.2 U$4.24(DVDD)
EN_3: U$4.22(ENABLE) ; also sheet 4
FAULT_3: U$4.17(FAULT_N) ; also sheet 4
GHA_3: U12.1(GH) U$4.5(GHA)
GHB_3: U13.1(GH) U$4.12(GHB)
GHC_3: U11.1(GH) U$4.13(GHC)
GLA_3: U12.22(GL) U$4.7(GLA)
GLB_3: U13.22(GL) U$4.10(GLB)
GLC_3: U11.22(GL) U$4.15(GLC)
GND: C24.2 C25.2 R22.1 R24.1 R26.1 U$4.23(AGND) U$4.31(PGND) U$4.EP(PAD) ; also sheet 1,2,3,4,5,6,8
INHA_3: U$4.25(INHA) ; also sheet 4
INHB_3: U$4.27(INHB) ; also sheet 4
INHC_3: U$4.29(INHC) ; also sheet 4
INL_3: U$4.26(INLA) U$4.28(INLB) U$4.30(INLC) ; also sheet 4
N$12: R22.2 U$4.18(MODE)
N$27: C26.1 U$4.2(VCP)
N$28: C23.1 U$4.1(CPH)
N$29: C23.2 U$4.32(CPL)
N$30: R23.1 R24.2 U$4.19(IDRIVE)
N$32: R25.1 R26.2 U$4.20(VDS)
PHASE_A3: U12.3(VSW_2) U12.4(VSW_3) U12.5(VSW_4) U12.6(VSW_5) U12.7(VSW_6) U12.8(VSW_7) U12.9(VSW_8) U12.10(VSW_9) U12.11(VSW) ; also sheet 1
PHASE_B3: U13.3(VSW_2) U13.4(VSW_3) U13.5(VSW_4) U13.6(VSW_5) U13.7(VSW_6) U13.8(VSW_7) U13.9(VSW_8) U13.10(VSW_9) U13.11(VSW) ; also sheet 1
PHASE_C3: U11.3(VSW_2) U11.4(VSW_3) U11.5(VSW_4) U11.6(VSW_5) U11.7(VSW_6) U11.8(VSW_7) U11.9(VSW_8) U11.10(VSW_9) U11.11(VSW) ; also sheet 1
SHA_3: U12.2(SH) U$4.6(SHA)
SHB_3: U13.2(SH) U$4.11(SHB)
SHC_3: U11.2(SH) U$4.14(SHC)
SLA_3: U12.12(PGND_2) U12.13(PGND_3) U12.14(PGND_4) U12.15(PGND_5) U12.16(PGND_6) U12.17(PGND_7) U12.18(PGND_8) U12.19(PGND_9) U12.20(PGND) U$4.8(SLA)
SLB_3: U13.12(PGND_2) U13.13(PGND_3) U13.14(PGND_4) U13.15(PGND_5) U13.16(PGND_6) U13.17(PGND_7) U13.18(PGND_8) U13.19(PGND_9) U13.20(PGND) U$4.9(SLB)
SLC_3: U11.12(PGND_2) U11.13(PGND_3) U11.14(PGND_4) U11.15(PGND_5) U11.16(PGND_6) U11.17(PGND_7) U11.18(PGND_8) U11.19(PGND_9) U11.20(PGND) U$4.16(SLC)
VM_3: C25.1 C26.2 U11.27(VIN) U12.27(VIN) U13.27(VIN) U$4.3(VM) U$4.4(VDRAIN)
Unconnected: U11.21(NC_2) U11.23(NC_3) U11.24(NC_4) U11.25(NC_5) U11.26(NC) U12.21(NC_2) U12.23(NC_3) U12.24(NC_4) U12.25(NC_5) U12.26(NC) U13.21(NC_2) U13.23(NC_3) U13.24(NC_4) U13.25(NC_5) U13.26(NC) U$4.21(NC)

### Notes on the sheet
- For IDRIVE and VDS,only one resistor will be used based on selected mode. See datasheet.

## Sheet 8 of 8
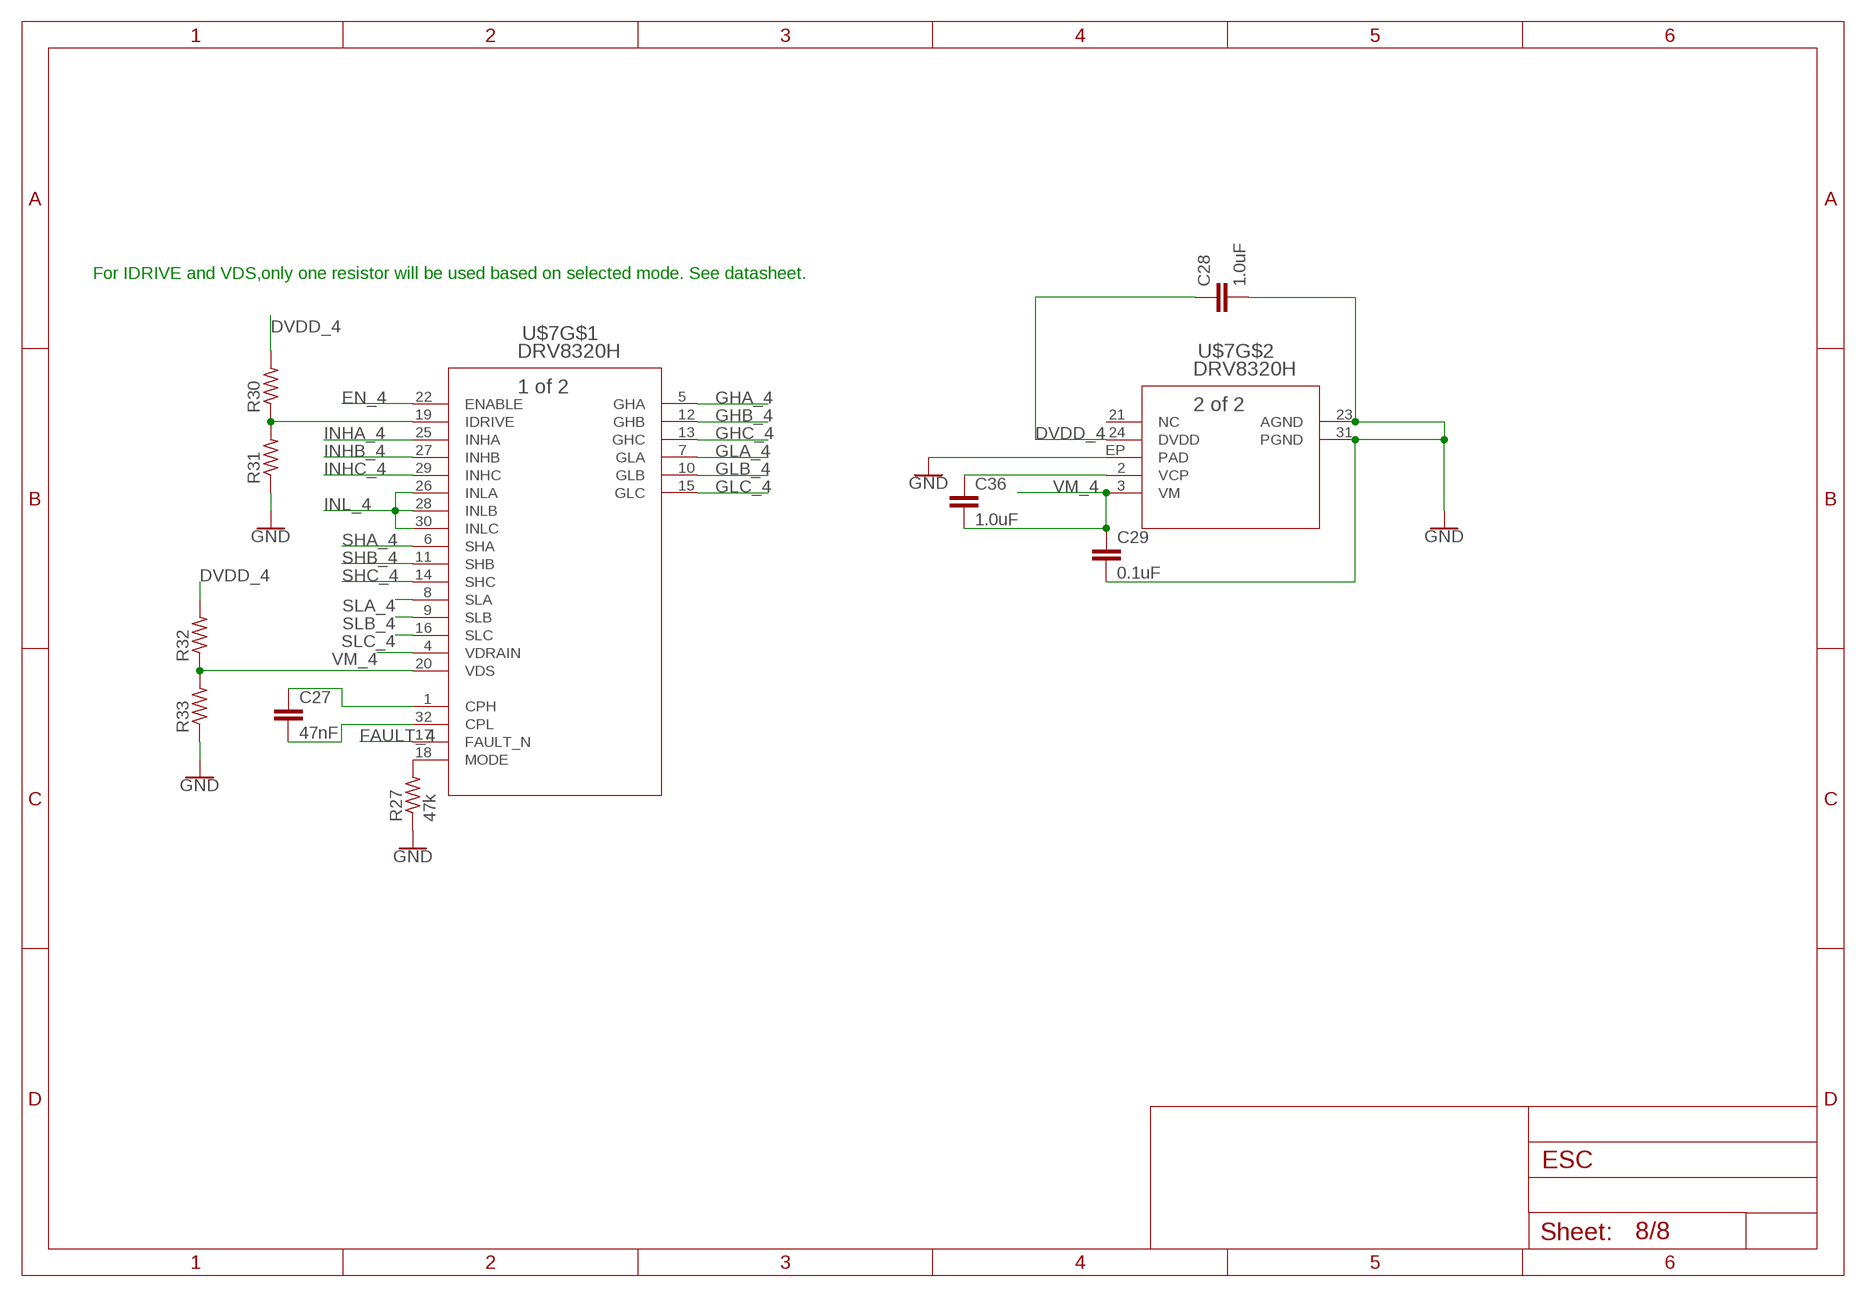
[diagram p10: schematic, sheet 8, part 1 of 2]
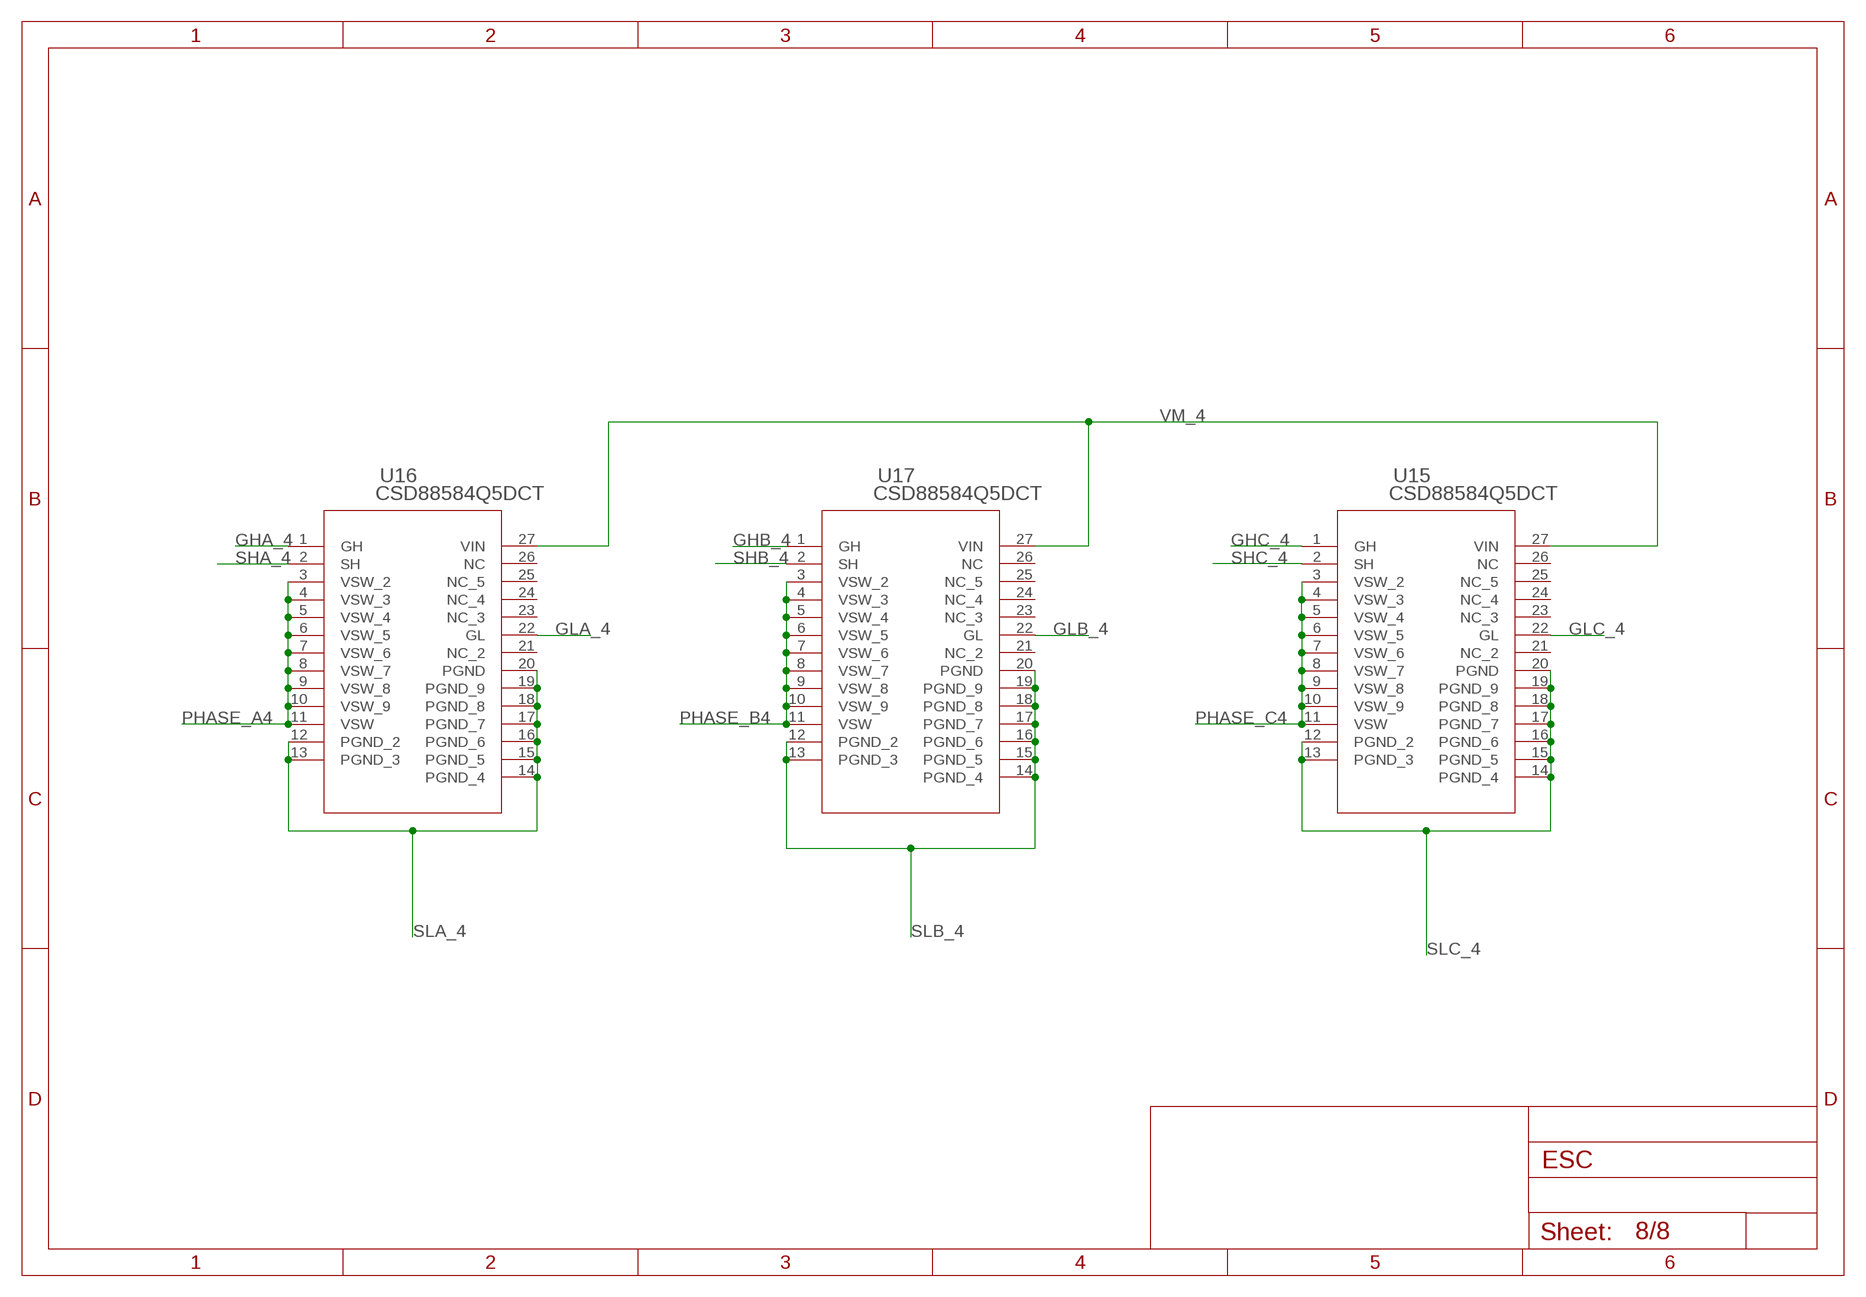
[diagram p11: schematic, sheet 8, part 2 of 2]

### Parts
C27  47nF  47NF-0603-25V-5%  [0603]
C28  1.0uF  1.0UF-0603-16V-10%  [0603]
C29  0.1uF  0.1UF-0603-25V-(+80/-20%)  [0603]
C36  1.0uF  1.0UF-0603-16V-10%  [0603]
R27  47k  R-US_R0603  [R0603]
R30  R-US_R0603  [R0603]
R31  R-US_R0603  [R0603]
R32  R-US_R0603  [R0603]
R33  R-US_R0603  [R0603]
U15  CSD88584Q5DCT  [DMM0022A]
U16  CSD88584Q5DCT  [DMM0022A]
U17  CSD88584Q5DCT  [DMM0022A]
U$7  DRV8320H  [QFN-32-5X5MM]

### Nets
DVDD_4: C28.1 R30.2 R32.2 U$7.24(DVDD)
EN_4: U$7.22(ENABLE) ; also sheet 4
FAULT_4: U$7.17(FAULT_N) ; also sheet 4
GHA_4: U16.1(GH) U$7.5(GHA)
GHB_4: U17.1(GH) U$7.12(GHB)
GHC_4: U15.1(GH) U$7.13(GHC)
GLA_4: U16.22(GL) U$7.7(GLA)
GLB_4: U17.22(GL) U$7.10(GLB)
GLC_4: U15.22(GL) U$7.15(GLC)
GND: C28.2 C29.2 R27.1 R31.1 R33.1 U$7.23(AGND) U$7.31(PGND) U$7.EP(PAD) ; also sheet 1,2,3,4,5,6,7
INHA_4: U$7.25(INHA) ; also sheet 4
INHB_4: U$7.27(INHB) ; also sheet 4
INHC_4: U$7.29(INHC) ; also sheet 4
INL_4: U$7.26(INLA) U$7.28(INLB) U$7.30(INLC) ; also sheet 4
N$13: R27.2 U$7.18(MODE)
N$33: C36.1 U$7.2(VCP)
N$35: C27.1 U$7.1(CPH)
N$36: C27.2 U$7.32(CPL)
N$37: R30.1 R31.2 U$7.19(IDRIVE)
N$39: R32.1 R33.2 U$7.20(VDS)
PHASE_A4: U16.3(VSW_2) U16.4(VSW_3) U16.5(VSW_4) U16.6(VSW_5) U16.7(VSW_6) U16.8(VSW_7) U16.9(VSW_8) U16.10(VSW_9) U16.11(VSW) ; also sheet 1
PHASE_B4: U17.3(VSW_2) U17.4(VSW_3) U17.5(VSW_4) U17.6(VSW_5) U17.7(VSW_6) U17.8(VSW_7) U17.9(VSW_8) U17.10(VSW_9) U17.11(VSW) ; also sheet 1
PHASE_C4: U15.3(VSW_2) U15.4(VSW_3) U15.5(VSW_4) U15.6(VSW_5) U15.7(VSW_6) U15.8(VSW_7) U15.9(VSW_8) U15.10(VSW_9) U15.11(VSW) ; also sheet 1
SHA_4: U16.2(SH) U$7.6(SHA)
SHB_4: U17.2(SH) U$7.11(SHB)
SHC_4: U15.2(SH) U$7.14(SHC)
SLA_4: U16.12(PGND_2) U16.13(PGND_3) U16.14(PGND_4) U16.15(PGND_5) U16.16(PGND_6) U16.17(PGND_7) U16.18(PGND_8) U16.19(PGND_9) U16.20(PGND) U$7.8(SLA)
SLB_4: U17.12(PGND_2) U17.13(PGND_3) U17.14(PGND_4) U17.15(PGND_5) U17.16(PGND_6) U17.17(PGND_7) U17.18(PGND_8) U17.19(PGND_9) U17.20(PGND) U$7.9(SLB)
SLC_4: U15.12(PGND_2) U15.13(PGND_3) U15.14(PGND_4) U15.15(PGND_5) U15.16(PGND_6) U15.17(PGND_7) U15.18(PGND_8) U15.19(PGND_9) U15.20(PGND) U$7.16(SLC)
VM_4: C29.1 C36.2 U15.27(VIN) U16.27(VIN) U17.27(VIN) U$7.3(VM) U$7.4(VDRAIN)
Unconnected: U15.21(NC_2) U15.23(NC_3) U15.24(NC_4) U15.25(NC_5) U15.26(NC) U16.21(NC_2) U16.23(NC_3) U16.24(NC_4) U16.25(NC_5) U16.26(NC) U17.21(NC_2) U17.23(NC_3) U17.24(NC_4) U17.25(NC_5) U17.26(NC) U$7.21(NC)

### Notes on the sheet
- For IDRIVE and VDS,only one resistor will be used based on selected mode. See datasheet.

## Library data of the parts
C1 C3 = SparkFun-Capacitors:2.2UF: 2.2µF ceramic capacitors A capacitor is a passive two-terminal electrical component used to store electrical energy temporarily in an electric field.; PROD_ID: CAP-07888
C2 C4 C5 C10-C12 C16 C30 C32-C35 C38-C41 = SparkFun-Capacitors:4.7UF: 4.7µF ceramic capacitors A capacitor is a passive two-terminal electrical component used to store electrical energy temporarily in an electric field.; PROD_ID: CAP-08280
C6 C15 C21 C25 C29 C31 = SparkFun-Capacitors:0.1UF: 0.1µF ceramic capacitors A capacitor is a passive two-terminal electrical component used to store electrical energy temporarily in an electric field.; PROD_ID: CAP-00810
C13 C19 C23 C27 = SparkFun-Capacitors:47NF: 47nF ceramic capacitors A capacitor is a passive two-terminal electrical component used to store electrical energy temporarily in an electric field.; PROD_ID: CAP-08605
C14 C17 C20 C22 C24 C26 C28 C36 = SparkFun-Capacitors:1.0UF: 1µF ceramic capacitors A capacitor is a passive two-terminal electrical component used to store electrical energy temporarily in an electric field.; PROD_ID: CAP-00868
GREEN_LED RED_LED = VESC_SHIT:TLMS1100-GS08; MANUFACTURER_PART_NUMBER: TLMS1100GS08; VENDOR: Vishay
J1-J4 = VESC_SHIT:1755529: Motor Connector (Female); MANUFACTURER_PART_NUMBER: 1755529; VENDOR: Phoenix Contact
R1-R5 = SparkFun-Resistors:1KOHM: 1kΩ resistor A resistor is a passive two-terminal electrical component that implements electrical resistance as a circuit element. Resistors act to reduce current flow, and, at the same time, act to lower voltage levels within circuits. - Wikipedia; PROD_ID: RES-07856
R6 = SparkFun-Resistors:1.5KOHM: 1.5kΩ resistor A resistor is a passive two-terminal electrical component that implements electrical resistance as a circuit element. Resistors act to reduce current flow, and, at the same time, act to lower voltage levels within circuits. - Wikipedia; PROD_ID: RES-08306
R7-R11 R17-R27 R30-R33 = rcl:R-US_: RESISTOR, American symbol; SPICEPREFIX: R
R28 R29 = SparkFun-Resistors:1KOHM: 1kΩ resistor A resistor is a passive two-terminal electrical component that implements electrical resistance as a circuit element. Resistors act to reduce current flow, and, at the same time, act to lower voltage levels within circuits. - Wikipedia; PROD_ID: RES-07856; VALUE: 1k
RESET1 = DiscreteComponents:SWITCH
SV2 = con-lsta:FE05-1: FEMALE HEADER; OC_FARNELL: unknown; OC_NEWARK: unknown
U1 = VESC_SHIT:STM32F405RGT6: Microcontroller; MANUFACTURER_PART_NUMBER: STM32F405RGT6; VENDOR: STMicroelectronics
U2-U4 U8-U13 U15-U17 = VESC_SHIT:CSD88584Q5DCT; MANUFACTURER_PART_NUMBER: CSD88584Q5DCT; VENDOR: Texas Instruments
U14 = SN74CBTLV3257PWR:SN74CBTLV3257PWR
U$2-U$4 U$7 = VESC_SHIT:DRV8320H
U$5 = ESC_to_Backplane_Connectors:ESC2BACKPLANE
U$6 = PI_Shield_Library:TCAN337D
Y1 = ECS-80-S-4X:ECS-80-S-4X: CRYSTAL T/H; DESCRIPTION: Crystal 8MHz Series 2-Pin HC-49/U; DIGI-KEY_PART_NUMBER: X1057-ND; DIGI-KEY_PURCHASE_URL: https://www.digikey.com/product-detail/en/ecs-inc/ECS-80-S-4X/X1057-ND/827549?utm_source=snapeda&utm_medium=aggregator&utm_campaign=symbol; MF: ECS International; MP: ECS-80-S-4X; PACKAGE: HC-49/US ECS International